# Altium project ZYNQ_IPMC.PrjPcb (part 1 of 2)
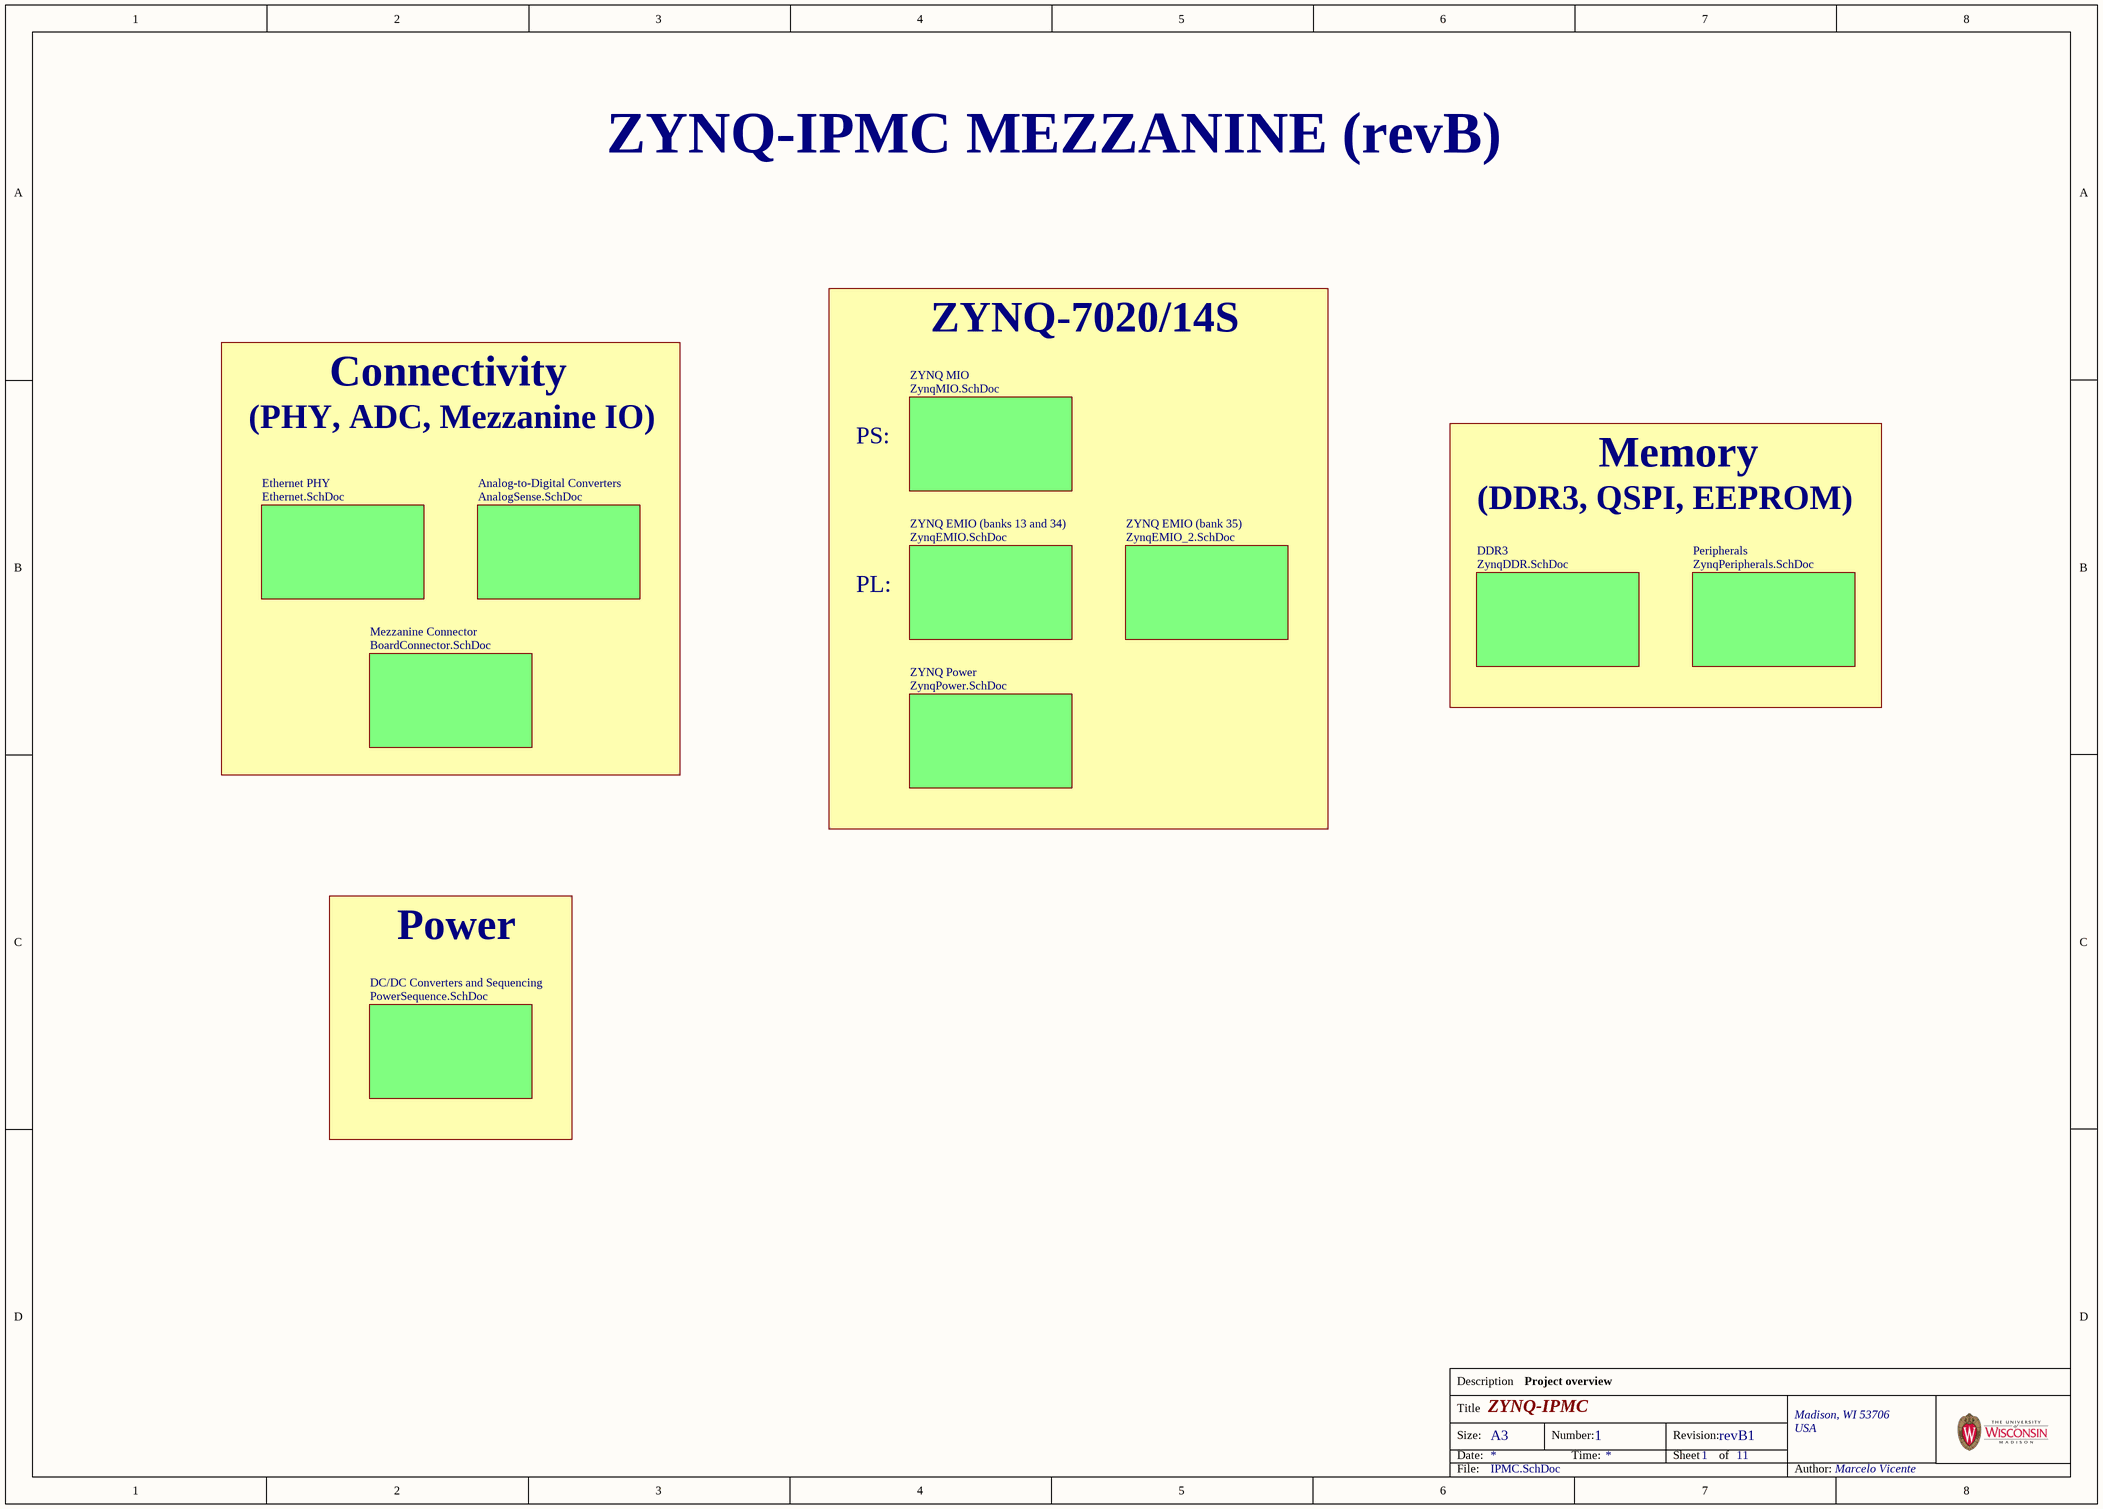
[diagram p0: IPMC.SchDoc]
Address1: Madison, WI 53706; Address2: USA; Author: Marcelo Vicente; Company: Univ. Wisconsin-Madison; Revision: revB1; Title: ZYNQ-IPMC
11 sheets, 308 parts. Net scope: global (net labels, ports and power ports of the same name join across sheets).
Board file: ZYNQ_IPMC.PcbDoc
Sheets:
  IPMC.SchDoc
    ZYNQ MIO = ZynqMIO.SchDoc
    ZYNQ EMIO (banks 13 and 34) = ZynqEMIO.SchDoc
    ZYNQ EMIO (bank 35) = ZynqEMIO_2.SchDoc
    ZYNQ Power = ZynqPower.SchDoc
    DDR3 = ZynqDDR.SchDoc
    Ethernet PHY = Ethernet.SchDoc
    Peripherals = ZynqPeripherals.SchDoc
    Analog-to-Digital Converters = AnalogSense.SchDoc
    DC/DC Converters and Sequencing = PowerSequence.SchDoc
    Mezzanine Connector = BoardConnector.SchDoc

## Sheet IPMC.SchDoc: ZYNQ-IPMC
size A3; Author: Marcelo Vicente; CompanyName: Univ. Wisconsin-Madison; Organization: Univ. Wisconsin-Madison; Address1: Madison, WI 53706; DocumentNumber: 1; Revision: revB1; SheetNumber: 1; SheetTotal: 11; ProjectName: ZYNQ-IPMC

### Sub-sheets
Analog-to-Digital Converters = AnalogSense.SchDoc: no entries
DC/DC Converters and Sequencing = PowerSequence.SchDoc: no entries
DDR3 = ZynqDDR.SchDoc: no entries
Ethernet PHY = Ethernet.SchDoc: no entries
Mezzanine Connector = BoardConnector.SchDoc: no entries
Peripherals = ZynqPeripherals.SchDoc: no entries
ZYNQ EMIO (bank 35) = ZynqEMIO_2.SchDoc: no entries
ZYNQ EMIO (banks 13 and 34) = ZynqEMIO.SchDoc: no entries
ZYNQ MIO = ZynqMIO.SchDoc: no entries
ZYNQ Power = ZynqPower.SchDoc: no entries

### Notes on the sheet
- ZYNQ-IPMC MEZZANINE (revB)
- ZYNQ-7020/14S
- (PHY, ADC, Mezzanine IO)
- Connectivity
- PS:
- (DDR3, QSPI, EEPROM)
- Memory
- PL:
- Power
- Project overview
- Description
- Title
- Size:
- Date:
- A3
- Number:
- Time:
- Revision:
- Sheet
- of
- File:
- Author:

## Sheet ZynqMIO.SchDoc: ZYNQ-IPMC
size A3; Author: Marcelo Vicente; CompanyName: Univ. Wisconsin-Madison; Organization: Univ. Wisconsin-Madison; Address1: Madison, WI 53706; DocumentNumber: 4; Revision: revB1; SheetNumber: 4; SheetTotal: 11; ProjectName: ZYNQ-IPMC
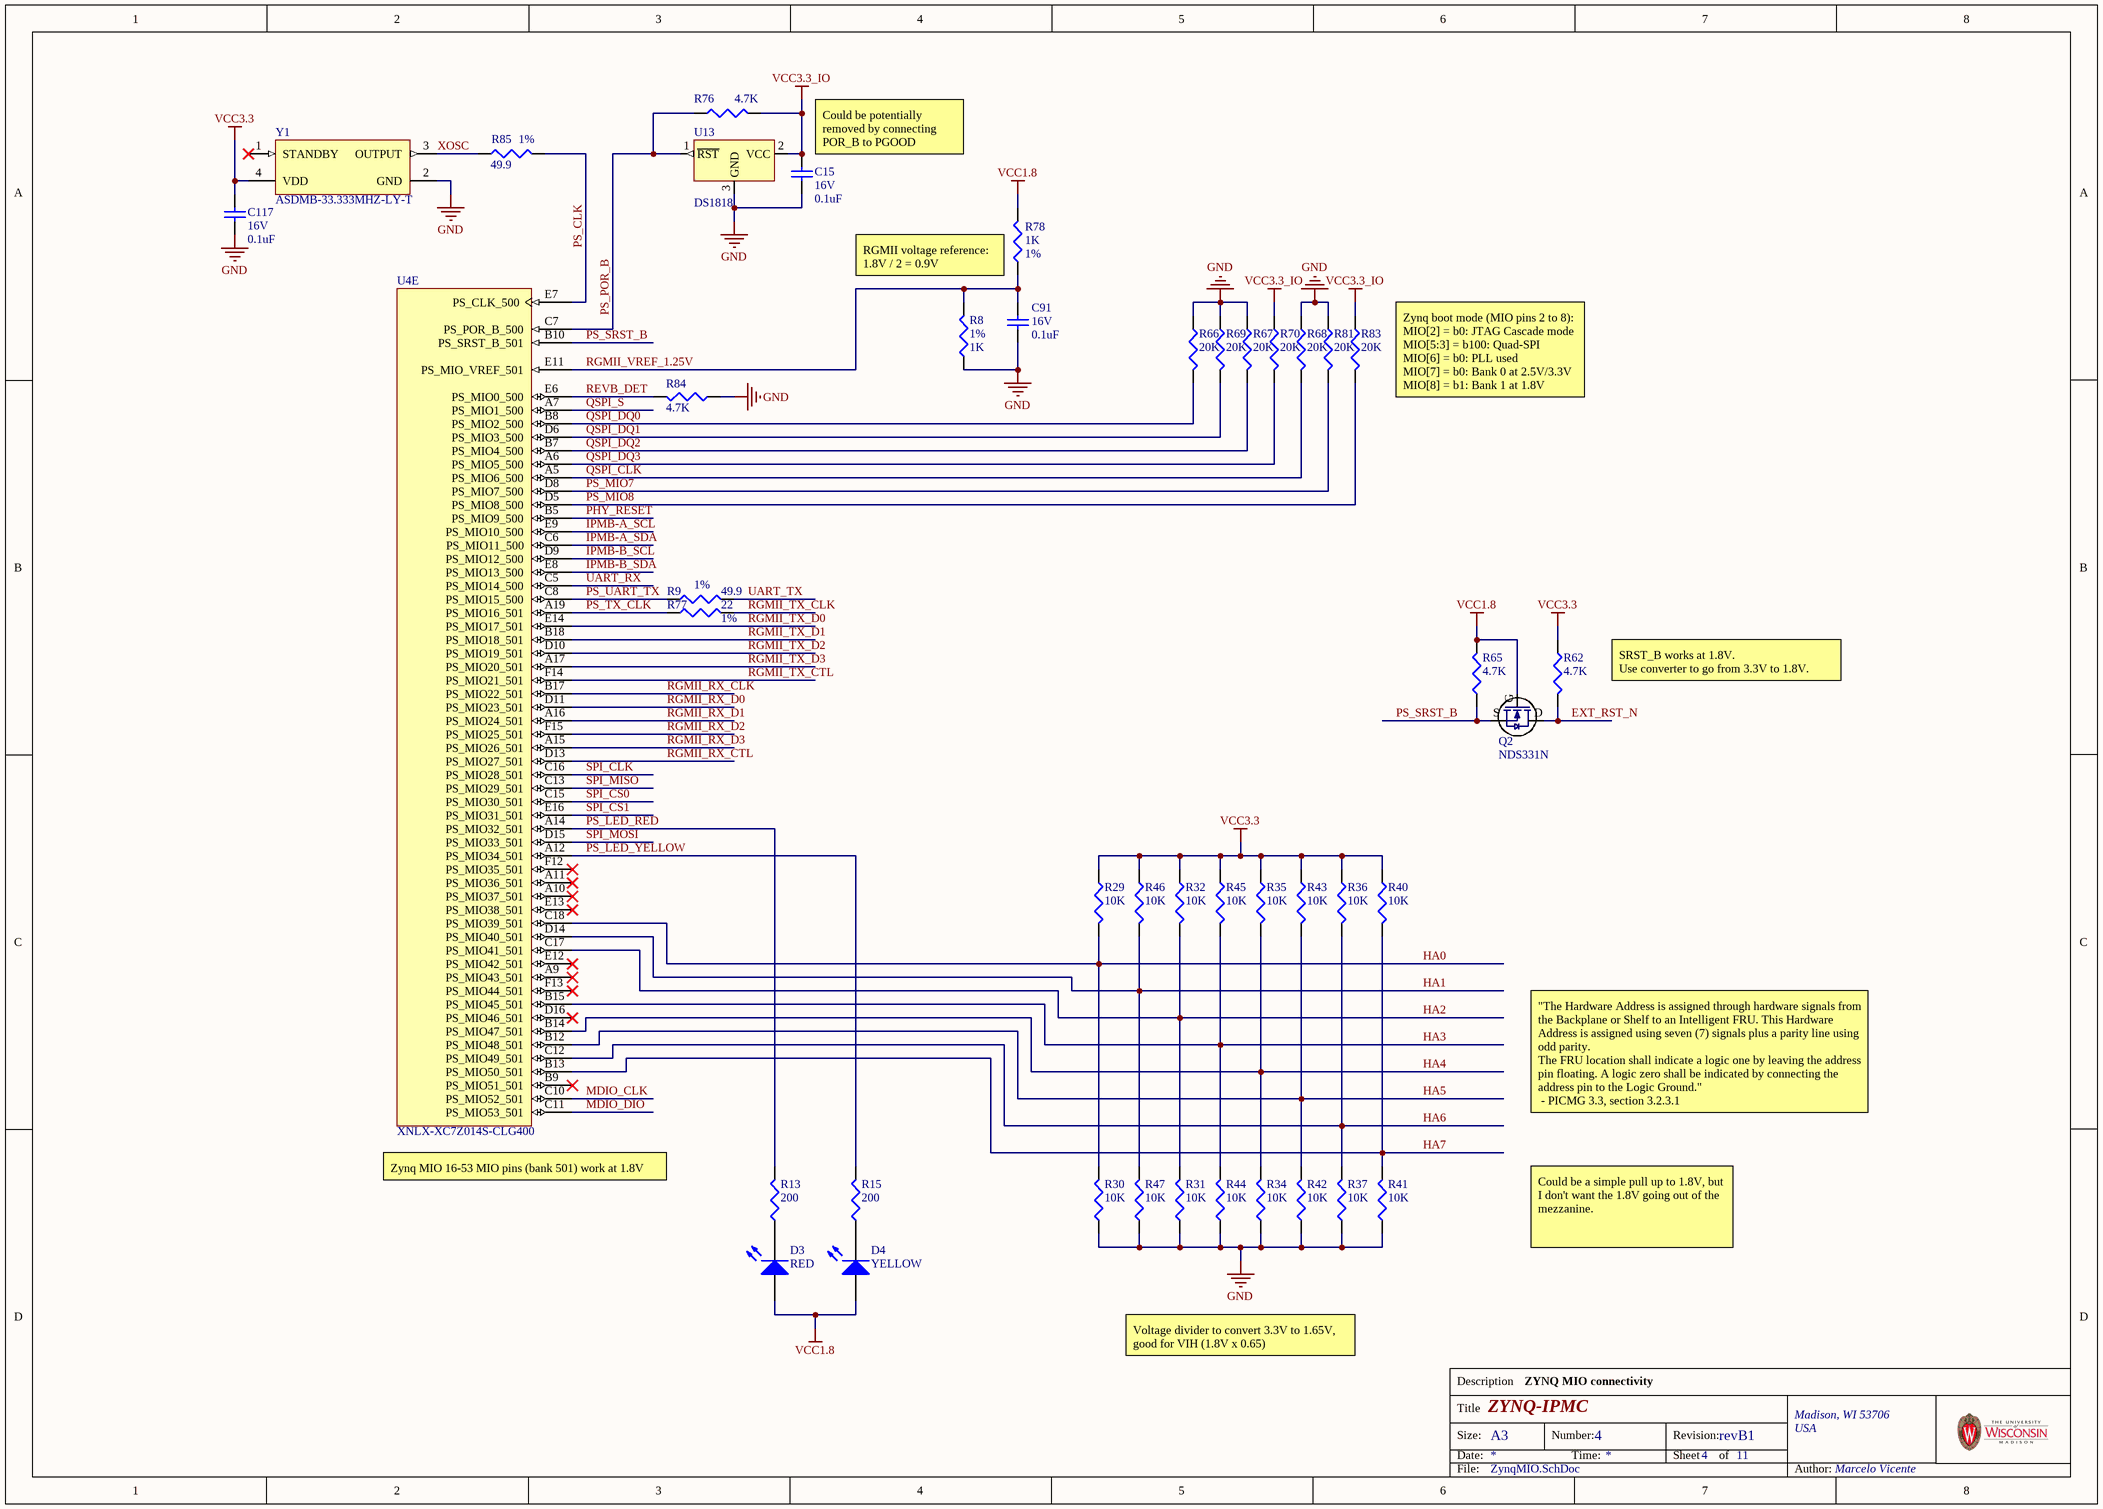
[diagram p1: ZynqMIO.SchDoc]

### Parts
C15  value 0.1uF  Rating: 16V  [C0402_IPC_H]  (hidden comment: ?)
C91  value 0.1uF  Rating: 16V  [C0402_IPC_H]  (hidden comment: ?)
C117  value 0.1uF  Rating: 16V  [C0402_IPC_H]  (hidden comment: ?)
D3  value RED  [LED0603_M]  (hidden comment: ?)
D4  value YELLOW  [LED0603_M]  (hidden comment: ?)
Q2  NDS331N  [SOT23-H]
R8  value 1K  Tolerance: 1%  [R0402_IPC_H]  (hidden comment: ?)
R9  value 49.9  Tolerance: 1%  [R0402_IPC_H]  (hidden comment: ?)
R13  value 200  [R0402_IPC_H]  (hidden comment: ?)
R15  value 200  [R0402_IPC_H]  (hidden comment: ?)
R29  value 10K  [R0201_IPC_H]  (hidden comment: ?)
R30  value 10K  [R0201_IPC_H]  (hidden comment: ?)
R31  value 10K  [R0201_IPC_H]  (hidden comment: ?)
R32  value 10K  [R0201_IPC_H]  (hidden comment: ?)
R34  value 10K  [R0201_IPC_H]  (hidden comment: ?)
R35  value 10K  [R0201_IPC_H]  (hidden comment: ?)
R36  value 10K  [R0201_IPC_H]  (hidden comment: ?)
R37  value 10K  [R0201_IPC_H]  (hidden comment: ?)
R40  value 10K  [R0201_IPC_H]  (hidden comment: ?)
R41  value 10K  [R0201_IPC_H]  (hidden comment: ?)
R42  value 10K  [R0201_IPC_H]  (hidden comment: ?)
R43  value 10K  [R0201_IPC_H]  (hidden comment: ?)
R44  value 10K  [R0201_IPC_H]  (hidden comment: ?)
R45  value 10K  [R0201_IPC_H]  (hidden comment: ?)
R46  value 10K  [R0201_IPC_H]  (hidden comment: ?)
R47  value 10K  [R0201_IPC_H]  (hidden comment: ?)
R62  value 4.7K  [R0402_IPC_H]  (hidden comment: ?)
R65  value 4.7K  [R0402_IPC_H]  (hidden comment: ?)
R66  value 20K  [R0402_IPC_H]  (hidden comment: ?)
R67  value 20K  [R0402_IPC_H]  (hidden comment: ?)
R68  value 20K  [R0402_IPC_H]  (hidden comment: ?)
R69  value 20K  [R0402_IPC_H]  (hidden comment: ?)
R70  value 20K  [R0402_IPC_H]  (hidden comment: ?)
R76  value 4.7K  [R0402_IPC_H]  (hidden comment: ?)
R77  value 22  Tolerance: 1%  [R0201_IPC_H]  (hidden comment: ?)
R78  value 1K  Tolerance: 1%  [R0402_IPC_H]  (hidden comment: ?)
R81  value 20K  [R0402_IPC_H]  (hidden comment: ?)
R83  value 20K  [R0402_IPC_H]  (hidden comment: ?)
R84  value 4.7K  [R0402_IPC_H]  (hidden comment: ?)
R85  value 49.9  Tolerance: 1%  [R0402_IPC_H]  (hidden comment: ?)
U4  XNLX-XC7Z014S-CLG400  [CLG400]  (part E of 9)
U13  DS1818  [SOT23-H]
Y1  ASDMB-33.333MHZ-LY-T  [ABRA-ASDMB-4_V]

### Nets
GND: C15.1 C91.1 C117.1 R8.2 R30.1 R31.1 R34.1 R37.1 R41.1 R42.1 R44.1 R47.1 R66.1 R67.1 R68.1 R69.1 R81.1 R84.1 U13.3(GND) Y1.2(GND)
VCC1.8: D3.1(A) D4.1(A) Q2.G R65.2 R78.1
VCC3.3: C117.2 R29.1 R32.1 R35.1 R36.1 R40.1 R43.1 R45.1 R46.1 R62.1 Y1.4(VDD)
VCC3.3_IO: C15.2 R70.1 R76.1 R83.1 U13.2(VCC)
~{QSPI_S}: U4.A7(PS_MIO1_500)
~{SPI_CS0}: U4.C15(PS_MIO30_501)
~{SPI_CS1}: U4.E16(PS_MIO31_501)
EXT_RST_N: Q2.D R62.2
HA0: R29.2 R30.2 U4.C18(PS_MIO39_501)
HA1: R46.2 R47.2 U4.D14(PS_MIO40_501)
HA2: R31.2 R32.2 U4.C17(PS_MIO41_501)
HA3: R44.2 R45.2 U4.B15(PS_MIO45_501)
HA4: R34.2 R35.2 U4.B14(PS_MIO47_501)
HA5: R42.2 R43.2 U4.B12(PS_MIO48_501)
HA6: R36.2 R37.2 U4.C12(PS_MIO49_501)
HA7: R40.2 R41.2 U4.B13(PS_MIO50_501)
IPMB-A_SCL: U4.E9(PS_MIO10_500)
IPMB-A_SDA: U4.C6(PS_MIO11_500)
IPMB-B_SCL: U4.D9(PS_MIO12_500)
IPMB-B_SDA: U4.E8(PS_MIO13_500)
MDIO_CLK: U4.C10(PS_MIO52_501)
MDIO_DIO: U4.C11(PS_MIO53_501)
PHY_RESET: U4.B5(PS_MIO9_500)
PS_CLK: R85.1 U4.E7(PS_CLK_500)
PS_LED_RED: R13.2 U4.A14(PS_MIO32_501)
PS_LED_YELLOW: R15.2 U4.A12(PS_MIO34_501)
PS_MIO7: R81.2 U4.D8(PS_MIO7_500)
PS_MIO8: R83.2 U4.D5(PS_MIO8_500)
PS_POR_B: R76.2 U4.C7(PS_POR_B_500) U13.1(~{RST})
PS_SRST_B: Q2.S R65.1 U4.B10(PS_SRST_B_501)
PS_TX_CLK: R77.1 U4.A19(PS_MIO16_501)
PS_UART_TX: R9.2 U4.C8(PS_MIO15_500)
QSPI_CLK: R68.2 U4.A5(PS_MIO6_500)
QSPI_DQ0: R66.2 U4.B8(PS_MIO2_500)
QSPI_DQ1: R69.2 U4.D6(PS_MIO3_500)
QSPI_DQ2: R67.2 U4.B7(PS_MIO4_500)
QSPI_DQ3: R70.2 U4.A6(PS_MIO5_500)
REVB_DET: R84.2 U4.E6(PS_MIO0_500)
RGMII_RX_CLK: U4.B17(PS_MIO22_501)
RGMII_RX_CTL: U4.D13(PS_MIO27_501)
RGMII_RX_D0: U4.D11(PS_MIO23_501)
RGMII_RX_D1: U4.A16(PS_MIO24_501)
RGMII_RX_D2: U4.F15(PS_MIO25_501)
RGMII_RX_D3: U4.A15(PS_MIO26_501)
RGMII_TX_CLK: R77.2
RGMII_TX_CTL: U4.F14(PS_MIO21_501)
RGMII_TX_D0: U4.E14(PS_MIO17_501)
RGMII_TX_D1: U4.B18(PS_MIO18_501)
RGMII_TX_D2: U4.D10(PS_MIO19_501)
RGMII_TX_D3: U4.A17(PS_MIO20_501)
RGMII_VREF_1.25V: C91.2 R8.1 R78.2 U4.E11(PS_MIO_VREF_501)
SPI_CLK: U4.C16(PS_MIO28_501)
SPI_MISO: U4.C13(PS_MIO29_501)
SPI_MOSI: U4.D15(PS_MIO33_501)
UART_RX: U4.C5(PS_MIO14_500)
UART_TX: R9.1
XOSC: R85.2 Y1.3(OUTPUT)
NetD3_2: D3.2(K) R13.1
NetD4_2: D4.2(K) R15.1

Not connected (* = marked no-connect by the designer): U4 A9(PS_MIO43_501)* A10(PS_MIO37_501)* A11(PS_MIO36_501)* B9(PS_MIO51_501)* D16(PS_MIO46_501)* E12(PS_MIO42_501)* E13(PS_MIO38_501)* F12(PS_MIO35_501)* F13(PS_MIO44_501)*; Y1 1(STANDBY)*

### Notes on the sheet
- (near C15) Could be potentially removed by connecting POR_B to PGOOD
- (near R78) RGMII voltage reference:
  1.8V / 2 = 0.9V
- (near R83) Zynq boot mode (MIO pins 2 to 8):
  MIO[2] = b0: JTAG Cascade mode
  MIO[5:3] = b100: Quad-SPI
  MIO[6] = b0: PLL used
  MIO[7] = b0: Bank 0 at 2.5V/3.3V
  MIO[8] = b1: Bank 1 at 1.8V
- SRST_B works at 1.8V.
  Use converter to go from 3.3V to 1.8V.
- "The Hardware Address is assigned through hardware signals from the Backplane or Shelf to an Intelligent FRU. This Hardware Address is assigned using seven (7) signals plus a parity line using odd parity.
  The FRU location shall indicate a logic one by leaving the address pin floating. A logic zero shall be indicated by connecting the address pin to the Logic Ground."
  - PICMG 3.3, section 3.2.3.1
- (near U4) Zynq MIO 16-53 MIO pins (bank 501) work at 1.8V
- Could be a simple pull up to 1.8V, but I don't want the 1.8V going out of the mezzanine.
- Voltage divider to convert 3.3V to 1.65V, good for VIH (1.8V x 0.65)
- ZYNQ MIO connectivity
- Description
- Title
- Size:
- Date:
- A3
- Number:
- Time:
- Revision:
- Sheet
- of
- File:
- Author:

### Library data of the parts
C15 C91 C117 = Cap: Capacitor; Manufacturer: Murata; Part: GRM155R71C104KA88D; INVKEY: CP0402-0.1UF-16V-10%; PackageDescription: Chip Capacitor
D3 = LED: Light Emitting Diode; Manufacturer: Lite-On; Part: LTST-C190KRKT; INVKEY: LED-RD-TOP-0603
D4 = LED: Light Emitting Diode; Manufacturer: Lite-On; Part: LTST-C190KSKT; INVKEY: LED-YLW-TOP-0603
Q2 = NDS331N: N-Channel   Logic Level Enhancement Mode Field Effect Transistor; pin to pad: D>3 G>1 S>2; Manufacturer: Fairchild; INVKEY: FET-NDS331N-SSOT23; Part: NDS331N
R8 R78 = Res: Resistor; Manufacturer: Panasonic-ECG; Part: ERJ-2RKF1001X; INVKEY: RS0402-1K-1/10W-1%; PackageDescription: Chip Resistor
R9 R85 = Res: Resistor; Manufacturer: Panasonic; Part: ERJ-2RKF49R9X; INVKEY: RS0402-49R9-1/10W-1%; PackageDescription: Chip Resistor
R13 R15 = Res: Resistor; Manufacturer: Panasonic-ECG; Part: ERJ-2RKF2000X; Tolerance: 1%; INVKEY: RS0402-200R-1/10W-1%; PackageDescription: Chip Resistor
R29-R32 R34-R37 R40-R47 = Res: Resistor; Manufacturer: Panasonic; Part: ERJ-1GNF1002C; Tolerance: 1%; INVKEY: RS0201-10K-1/20W-1%; PackageDescription: Chip Resistor
R62 R65 R76 R84 = Res: Resistor; Manufacturer: Panasonic; Part: ERJ-2RKF4701X; Tolerance: 1%; INVKEY: RS0402-4K7-1/10W-1%; PackageDescription: Chip Resistor
R66-R70 R81 R83 = Res: Resistor; Manufacturer: Panasonic-ECG; Part: ERJ-2RKF2002X; Tolerance: 1%; INVKEY: RS0402-20K-1/10W-1%; PackageDescription: Chip Resistor
R77 = Res: Resistor; Manufacturer: Panasonic; Part: ERJ-1GNF22R0C; INVKEY: RS0201-22R-1/20W-1%; PackageDescription: Chip Resistor
U4 = XNLX-XC7Z020-CLG400: Manufacturer: Xilinx; Part: XC7Z014S-1CLG400C; INVKEY: ?
U13 = DS1818: 3.3V EconoReset with Pushbutton; Manufacturer: Maxim; Part: DS1818R-10; INVKEY: IC-RST-1818R-10
Y1 = CMP-0728-00001-1: Plastic Package Clock Oscillator, 3.6864 MHz Frequency, 15 pF Output Load, 4-Pin 2.5 x 2 x 0.9 mm SMD, -40 to 85 degC, RoHS, Reel; PartNumber: ASDMB-3.6864MHZ-LC-T; Manufacturer: Abracon; Disable Stand-by Current: 15 uA Max.; Output Load: 15 pF; Startup Time: 1.5 ms Typ.; Overall Freq.Stability: +/- 50 ppm (STD); Supply Voltage: 1.8 to 3.3 V; Disable Time: 20 ns Typ.; INVKEY: CRY-ASDMB-33.333MHZ; ComponentLink1Description: Manufacturer URL; RoHS: TRUE; PackageVersion: Oct-13; PackageDescription: 4-Pin SMD, Body 2.5 x 2 mm, Height 0.9 mm; DatasheetVersion: Oct-13; ComponentLink3URL: http://www.abracon.com/Oscillators/ASDMB.pdf; ComponentLink2Description: Datasheet; Mounting Technology: Surface Mount; ComponentLink2URL: http://www.abracon.com/Oscillators/ASDMB.pdf; ComponentLink3Description: Package Specification; PackageReference: ASDMB-4; ComponentLink1URL: http://www.abracon.com/; Operating Temperature Range: -40 to 85 degC; Packing: Reel; Frequency: 33.333 MHz; Part: ASDMB-33.333MHZ-LY

## Sheet ZynqEMIO.SchDoc: ZYNQ-IPMC
size A3; Author: Marcelo Vicente; CompanyName: Univ. Wisconsin-Madison; Organization: Univ. Wisconsin-Madison; Address1: Madison, WI 53706; DocumentNumber: 5; Revision: revB1; SheetNumber: 5; SheetTotal: 11; ProjectName: ZYNQ-IPMC
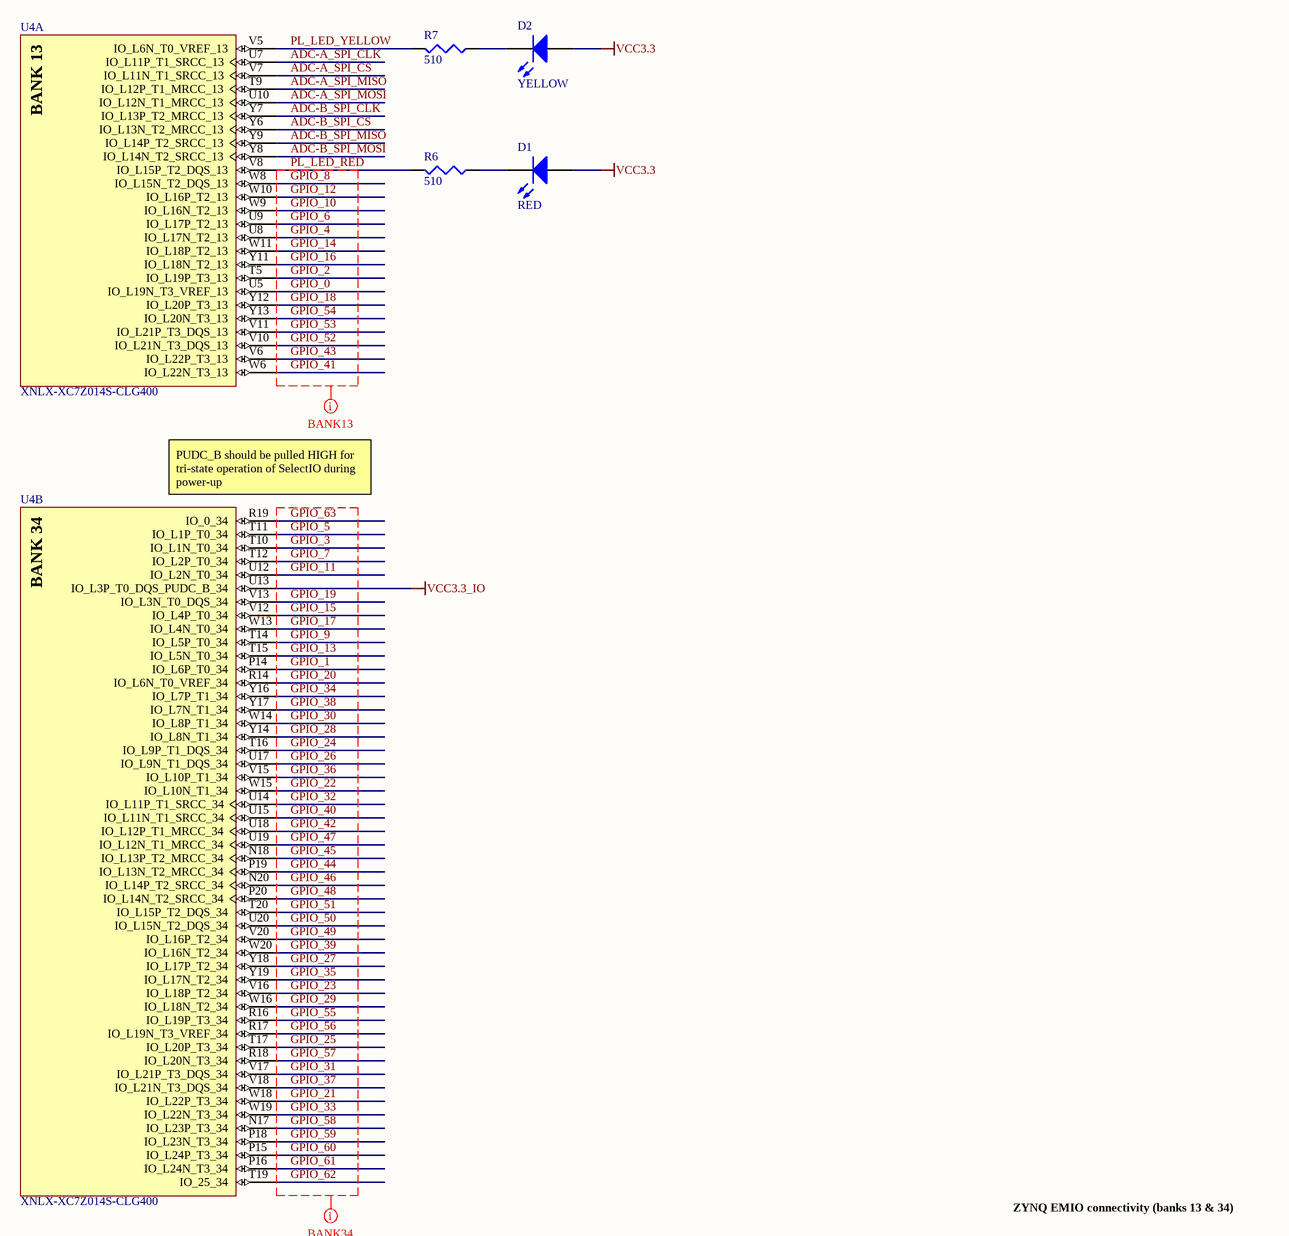
[diagram p2: ZynqEMIO.SchDoc]

### Parts
D1  value RED  [LED0603_M]  (hidden comment: ?)
D2  value YELLOW  [LED0603_M]  (hidden comment: ?)
R6  value 510  [R0402_IPC_H]  (hidden comment: ?)
R7  value 510  [R0402_IPC_H]  (hidden comment: ?)
U4  XNLX-XC7Z014S-CLG400  [CLG400]  (parts A,B of 9)

### Nets
VCC3.3: D1.1(A) D2.1(A)
VCC3.3_IO: U4.U13(IO_L3P_T0_DQS_PUDC_B_34)
~{ADC-A_SPI_CS}: U4.V7(IO_L11N_T1_SRCC_13)
~{ADC-B_SPI_CS}: U4.Y6(IO_L13N_T2_MRCC_13)
ADC-A_SPI_CLK: U4.U7(IO_L11P_T1_SRCC_13)
ADC-A_SPI_MISO: U4.T9(IO_L12P_T1_MRCC_13)
ADC-A_SPI_MOSI: U4.U10(IO_L12N_T1_MRCC_13)
ADC-B_SPI_CLK: U4.Y7(IO_L13P_T2_MRCC_13)
ADC-B_SPI_MISO: U4.Y9(IO_L14P_T2_SRCC_13)
ADC-B_SPI_MOSI: U4.Y8(IO_L14N_T2_SRCC_13)
GPIO_0: U4.U5(IO_L19N_T3_VREF_13)
GPIO_1: U4.P14(IO_L6P_T0_34)
GPIO_2: U4.T5(IO_L19P_T3_13)
GPIO_3: U4.T10(IO_L1N_T0_34)
GPIO_4: U4.U8(IO_L17N_T2_13)
GPIO_5: U4.T11(IO_L1P_T0_34)
GPIO_6: U4.U9(IO_L17P_T2_13)
GPIO_7: U4.T12(IO_L2P_T0_34)
GPIO_8: U4.W8(IO_L15N_T2_DQS_13)
GPIO_9: U4.T14(IO_L5P_T0_34)
GPIO_10: U4.W9(IO_L16N_T2_13)
GPIO_11: U4.U12(IO_L2N_T0_34)
GPIO_12: U4.W10(IO_L16P_T2_13)
GPIO_13: U4.T15(IO_L5N_T0_34)
GPIO_14: U4.W11(IO_L18P_T2_13)
GPIO_15: U4.V12(IO_L4P_T0_34)
GPIO_16: U4.Y11(IO_L18N_T2_13)
GPIO_17: U4.W13(IO_L4N_T0_34)
GPIO_18: U4.Y12(IO_L20P_T3_13)
GPIO_19: U4.V13(IO_L3N_T0_DQS_34)
GPIO_20: U4.R14(IO_L6N_T0_VREF_34)
GPIO_21: U4.W18(IO_L22P_T3_34)
GPIO_22: U4.W15(IO_L10N_T1_34)
GPIO_23: U4.V16(IO_L18P_T2_34)
GPIO_24: U4.T16(IO_L9P_T1_DQS_34)
GPIO_25: U4.T17(IO_L20P_T3_34)
GPIO_26: U4.U17(IO_L9N_T1_DQS_34)
GPIO_27: U4.Y18(IO_L17P_T2_34)
GPIO_28: U4.Y14(IO_L8N_T1_34)
GPIO_29: U4.W16(IO_L18N_T2_34)
GPIO_30: U4.W14(IO_L8P_T1_34)
GPIO_31: U4.V17(IO_L21P_T3_DQS_34)
GPIO_32: U4.U14(IO_L11P_T1_SRCC_34)
GPIO_33: U4.W19(IO_L22N_T3_34)
GPIO_34: U4.Y16(IO_L7P_T1_34)
GPIO_35: U4.Y19(IO_L17N_T2_34)
GPIO_36: U4.V15(IO_L10P_T1_34)
GPIO_37: U4.V18(IO_L21N_T3_DQS_34)
GPIO_38: U4.Y17(IO_L7N_T1_34)
GPIO_39: U4.W20(IO_L16N_T2_34)
GPIO_40: U4.U15(IO_L11N_T1_SRCC_34)
GPIO_41: U4.W6(IO_L22N_T3_13)
GPIO_42: U4.U18(IO_L12P_T1_MRCC_34)
GPIO_43: U4.V6(IO_L22P_T3_13)
GPIO_44: U4.P19(IO_L13N_T2_MRCC_34)
GPIO_45: U4.N18(IO_L13P_T2_MRCC_34)
GPIO_46: U4.N20(IO_L14P_T2_SRCC_34)
GPIO_47: U4.U19(IO_L12N_T1_MRCC_34)
GPIO_48: U4.P20(IO_L14N_T2_SRCC_34)
GPIO_49: U4.V20(IO_L16P_T2_34)
GPIO_50: U4.U20(IO_L15N_T2_DQS_34)
GPIO_51: U4.T20(IO_L15P_T2_DQS_34)
GPIO_52: U4.V10(IO_L21N_T3_DQS_13)
GPIO_53: U4.V11(IO_L21P_T3_DQS_13)
GPIO_54: U4.Y13(IO_L20N_T3_13)
GPIO_55: U4.R16(IO_L19P_T3_34)
GPIO_56: U4.R17(IO_L19N_T3_VREF_34)
GPIO_57: U4.R18(IO_L20N_T3_34)
GPIO_58: U4.N17(IO_L23P_T3_34)
GPIO_59: U4.P18(IO_L23N_T3_34)
GPIO_60: U4.P15(IO_L24P_T3_34)
GPIO_61: U4.P16(IO_L24N_T3_34)
GPIO_62: U4.T19(IO_25_34)
GPIO_63: U4.R19(IO_0_34)
PL_LED_RED: R6.2 U4.V8(IO_L15P_T2_DQS_13)
PL_LED_YELLOW: R7.2 U4.V5(IO_L6N_T0_VREF_13)
NetD1_2: D1.2(K) R6.1
NetD2_2: D2.2(K) R7.1

### Layout directives
net class BANK13: GPIO_0, GPIO_2, GPIO_4, GPIO_6, GPIO_8, GPIO_10, GPIO_12, GPIO_14, GPIO_16, GPIO_18, GPIO_41, GPIO_43, GPIO_52, GPIO_53, GPIO_54, PL_LED_RED
net class BANK34: GPIO_1, GPIO_3, GPIO_5, GPIO_7, GPIO_9, GPIO_11, GPIO_13, GPIO_15, GPIO_17, GPIO_19, GPIO_20, GPIO_21, GPIO_22, GPIO_23, GPIO_24, GPIO_25, GPIO_26, GPIO_27, GPIO_28, GPIO_29, GPIO_30, GPIO_31, GPIO_32, GPIO_33, GPIO_34, GPIO_35, GPIO_36, GPIO_37, GPIO_38, GPIO_39, GPIO_40, GPIO_42, GPIO_44, GPIO_45, GPIO_46, GPIO_47, GPIO_48, GPIO_49, GPIO_50, GPIO_51, GPIO_55, GPIO_56, GPIO_57, GPIO_58, GPIO_59, GPIO_60, GPIO_61, GPIO_62, GPIO_63

### Notes on the sheet
- (near U4) PUDC_B should be pulled HIGH for tri-state operation of SelectIO during power-up
- ZYNQ EMIO connectivity (banks 13 & 34)
- Description
- Title
- Size:
- Date:
- A3
- Number:
- Time:
- Revision:
- Sheet
- of
- File:
- Author:
- (in symbol XNLX-XC7Z020-CLG400, part A) BANK 13
- (in symbol XNLX-XC7Z020-CLG400, part B) BANK 34

### Library data of the parts
D1 = LED: as D3 on sheet ZynqMIO
D2 = LED: as D4 on sheet ZynqMIO
R6 R7 = Res: Resistor; Manufacturer: Panasonic-ECG; Part: ERJ-2RKF5100X; Tolerance: 1%; INVKEY: RS0402-510R-1/10W-1%; PackageDescription: Chip Resistor
U4 = XNLX-XC7Z020-CLG400: as U4 on sheet ZynqMIO; INVKEY: ?

## Sheet ZynqEMIO_2.SchDoc: ZYNQ-IPMC
size A3; Author: Marcelo Vicente; CompanyName: Univ. Wisconsin-Madison; Organization: Univ. Wisconsin-Madison; Address1: Madison, WI 53706; DocumentNumber: 6; Revision: revB1; SheetNumber: 6; SheetTotal: 11; ProjectName: ZYNQ-IPMC
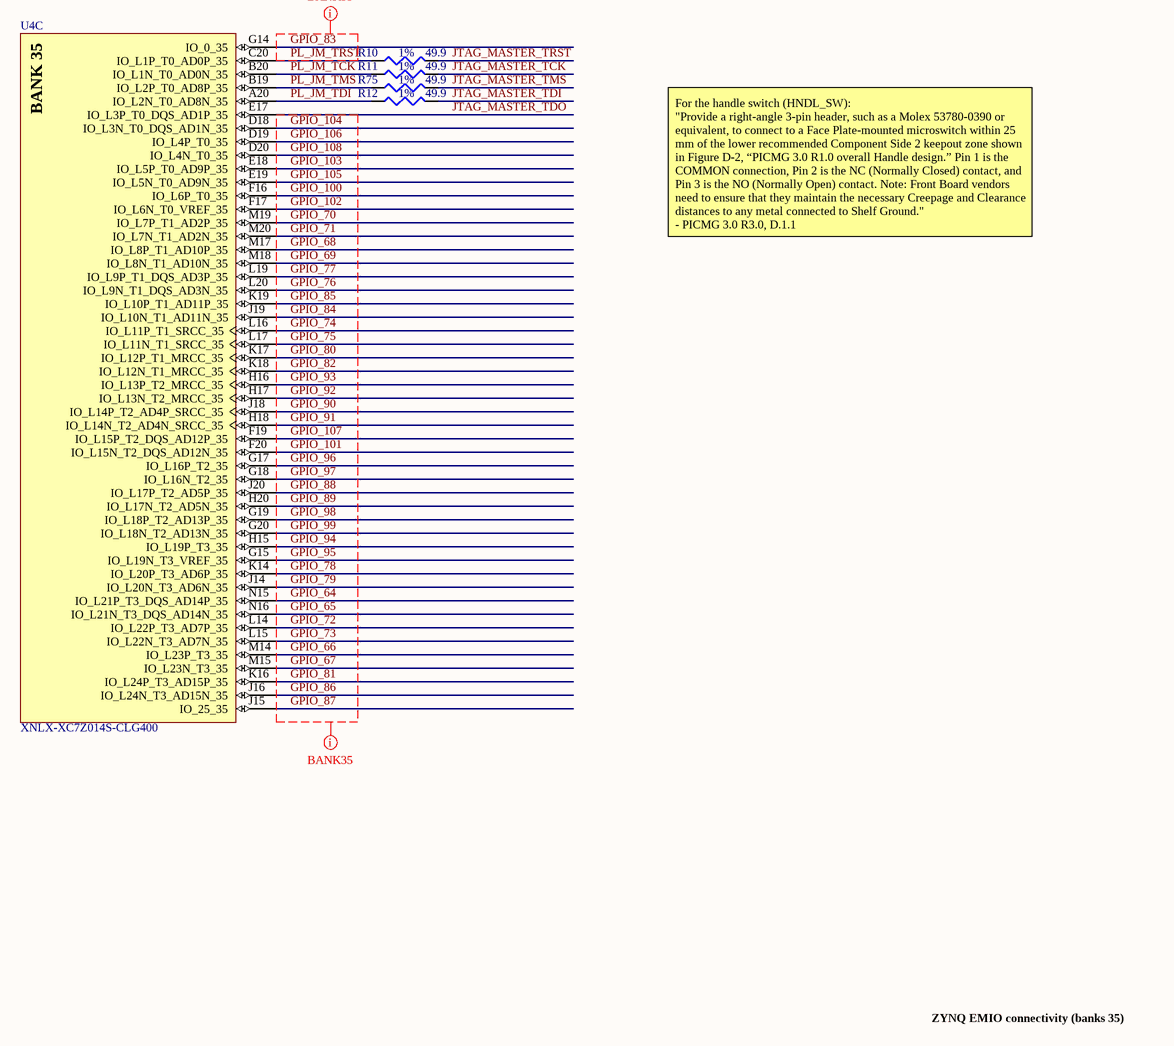
[diagram p3: ZynqEMIO_2.SchDoc]

### Parts
R10  value 49.9  Tolerance: 1%  [R0402_IPC_H]  (hidden comment: ?)
R11  value 49.9  Tolerance: 1%  [R0402_IPC_H]  (hidden comment: ?)
R12  value 49.9  Tolerance: 1%  [R0402_IPC_H]  (hidden comment: ?)
R75  value 49.9  Tolerance: 1%  [R0402_IPC_H]  (hidden comment: ?)
U4  XNLX-XC7Z014S-CLG400  [CLG400]  (part C of 9)

### Nets
GPIO_64: U4.N15(IO_L21P_T3_DQS_AD14P_35)
GPIO_65: U4.N16(IO_L21N_T3_DQS_AD14N_35)
GPIO_66: U4.M14(IO_L23P_T3_35)
GPIO_67: U4.M15(IO_L23N_T3_35)
GPIO_68: U4.M17(IO_L8P_T1_AD10P_35)
GPIO_69: U4.M18(IO_L8N_T1_AD10N_35)
GPIO_70: U4.M19(IO_L7P_T1_AD2P_35)
GPIO_71: U4.M20(IO_L7N_T1_AD2N_35)
GPIO_72: U4.L14(IO_L22P_T3_AD7P_35)
GPIO_73: U4.L15(IO_L22N_T3_AD7N_35)
GPIO_74: U4.L16(IO_L11P_T1_SRCC_35)
GPIO_75: U4.L17(IO_L11N_T1_SRCC_35)
GPIO_76: U4.L20(IO_L9N_T1_DQS_AD3N_35)
GPIO_77: U4.L19(IO_L9P_T1_DQS_AD3P_35)
GPIO_78: U4.K14(IO_L20P_T3_AD6P_35)
GPIO_79: U4.J14(IO_L20N_T3_AD6N_35)
GPIO_80: U4.K17(IO_L12P_T1_MRCC_35)
GPIO_81: U4.K16(IO_L24P_T3_AD15P_35)
GPIO_82: U4.K18(IO_L12N_T1_MRCC_35)
GPIO_83: U4.G14(IO_0_35)
GPIO_84: U4.J19(IO_L10N_T1_AD11N_35)
GPIO_85: U4.K19(IO_L10P_T1_AD11P_35)
GPIO_86: U4.J16(IO_L24N_T3_AD15N_35)
GPIO_87: U4.J15(IO_25_35)
GPIO_88: U4.J20(IO_L17P_T2_AD5P_35)
GPIO_89: U4.H20(IO_L17N_T2_AD5N_35)
GPIO_90: U4.J18(IO_L14P_T2_AD4P_SRCC_35)
GPIO_91: U4.H18(IO_L14N_T2_AD4N_SRCC_35)
GPIO_92: U4.H17(IO_L13N_T2_MRCC_35)
GPIO_93: U4.H16(IO_L13P_T2_MRCC_35)
GPIO_94: U4.H15(IO_L19P_T3_35)
GPIO_95: U4.G15(IO_L19N_T3_VREF_35)
GPIO_96: U4.G17(IO_L16P_T2_35)
GPIO_97: U4.G18(IO_L16N_T2_35)
GPIO_98: U4.G19(IO_L18P_T2_AD13P_35)
GPIO_99: U4.G20(IO_L18N_T2_AD13N_35)
GPIO_100: U4.F16(IO_L6P_T0_35)
GPIO_101: U4.F20(IO_L15N_T2_DQS_AD12N_35)
GPIO_102: U4.F17(IO_L6N_T0_VREF_35)
GPIO_103: U4.E18(IO_L5P_T0_AD9P_35)
GPIO_104: U4.D18(IO_L3N_T0_DQS_AD1N_35)
GPIO_105: U4.E19(IO_L5N_T0_AD9N_35)
GPIO_106: U4.D19(IO_L4P_T0_35)
GPIO_107: U4.F19(IO_L15P_T2_DQS_AD12P_35)
GPIO_108: U4.D20(IO_L4N_T0_35)
JTAG_MASTER_TCK: R11.1
JTAG_MASTER_TDI: R12.1
JTAG_MASTER_TDO: U4.E17(IO_L3P_T0_DQS_AD1P_35)
JTAG_MASTER_TMS: R75.1
JTAG_MASTER_TRST: R10.1
PL_JM_TCK: R11.2 U4.B20(IO_L1N_T0_AD0N_35)
PL_JM_TDI: R12.2 U4.A20(IO_L2N_T0_AD8N_35)
PL_JM_TMS: R75.2 U4.B19(IO_L2P_T0_AD8P_35)
PL_JM_TRST: R10.2 U4.C20(IO_L1P_T0_AD0P_35)

### Layout directives
net class BANK35: GPIO_64, GPIO_65, GPIO_66, GPIO_67, GPIO_68, GPIO_69, GPIO_70, GPIO_71, GPIO_72, GPIO_73, GPIO_74, GPIO_75, GPIO_76, GPIO_77, GPIO_78, GPIO_79, GPIO_80, GPIO_81, GPIO_82, GPIO_83, GPIO_84, GPIO_85, GPIO_86, GPIO_87, GPIO_88, GPIO_89, GPIO_90, GPIO_91, GPIO_92, GPIO_93, GPIO_94, GPIO_95, GPIO_96, GPIO_97, GPIO_98, GPIO_99, GPIO_100, GPIO_101, GPIO_102, GPIO_103, GPIO_104, GPIO_105, GPIO_106, GPIO_107, GPIO_108, PL_JM_TRST

### Notes on the sheet
- For the handle switch (HNDL_SW):
  "Provide a right-angle 3-pin header, such as a Molex 53780-0390 or equivalent, to connect to a Face Plate-mounted microswitch within 25 mm of the lower recommended Component Side 2 keepout zone shown in Figure D-2, “PICMG 3.0 R1.0 overall Handle design.” Pin 1 is the COMMON connection, Pin 2 is the NC (Normally Closed) contact, and Pin 3 is the NO (Normally Open) contact. Note: Front Board vendors need to ensure that they maintain the necessary Creepage and Clearance distances to any metal connected to Shelf Ground."
  - PICMG 3.0 R3.0, D.1.1
- ZYNQ EMIO connectivity (banks 35)
- Description
- Title
- Size:
- Date:
- A3
- Number:
- Time:
- Revision:
- Sheet
- of
- File:
- Author:
- (in symbol XNLX-XC7Z020-CLG400, part C) BANK 35

### Library data of the parts
R10-R12 R75 = Res: as R9 on sheet ZynqMIO; PackageDescription: Chip Resistor
U4 = XNLX-XC7Z020-CLG400: as U4 on sheet ZynqMIO; INVKEY: ?

## Sheet ZynqPower.SchDoc: ZYNQ-IPMC
size A3; Author: Marcelo Vicente; CompanyName: Univ. Wisconsin-Madison; Organization: Univ. Wisconsin-Madison; Address1: Madison, WI 53706; DocumentNumber: 3; Revision: revB1; SheetNumber: 3; SheetTotal: 11; ProjectName: ZYNQ-IPMC
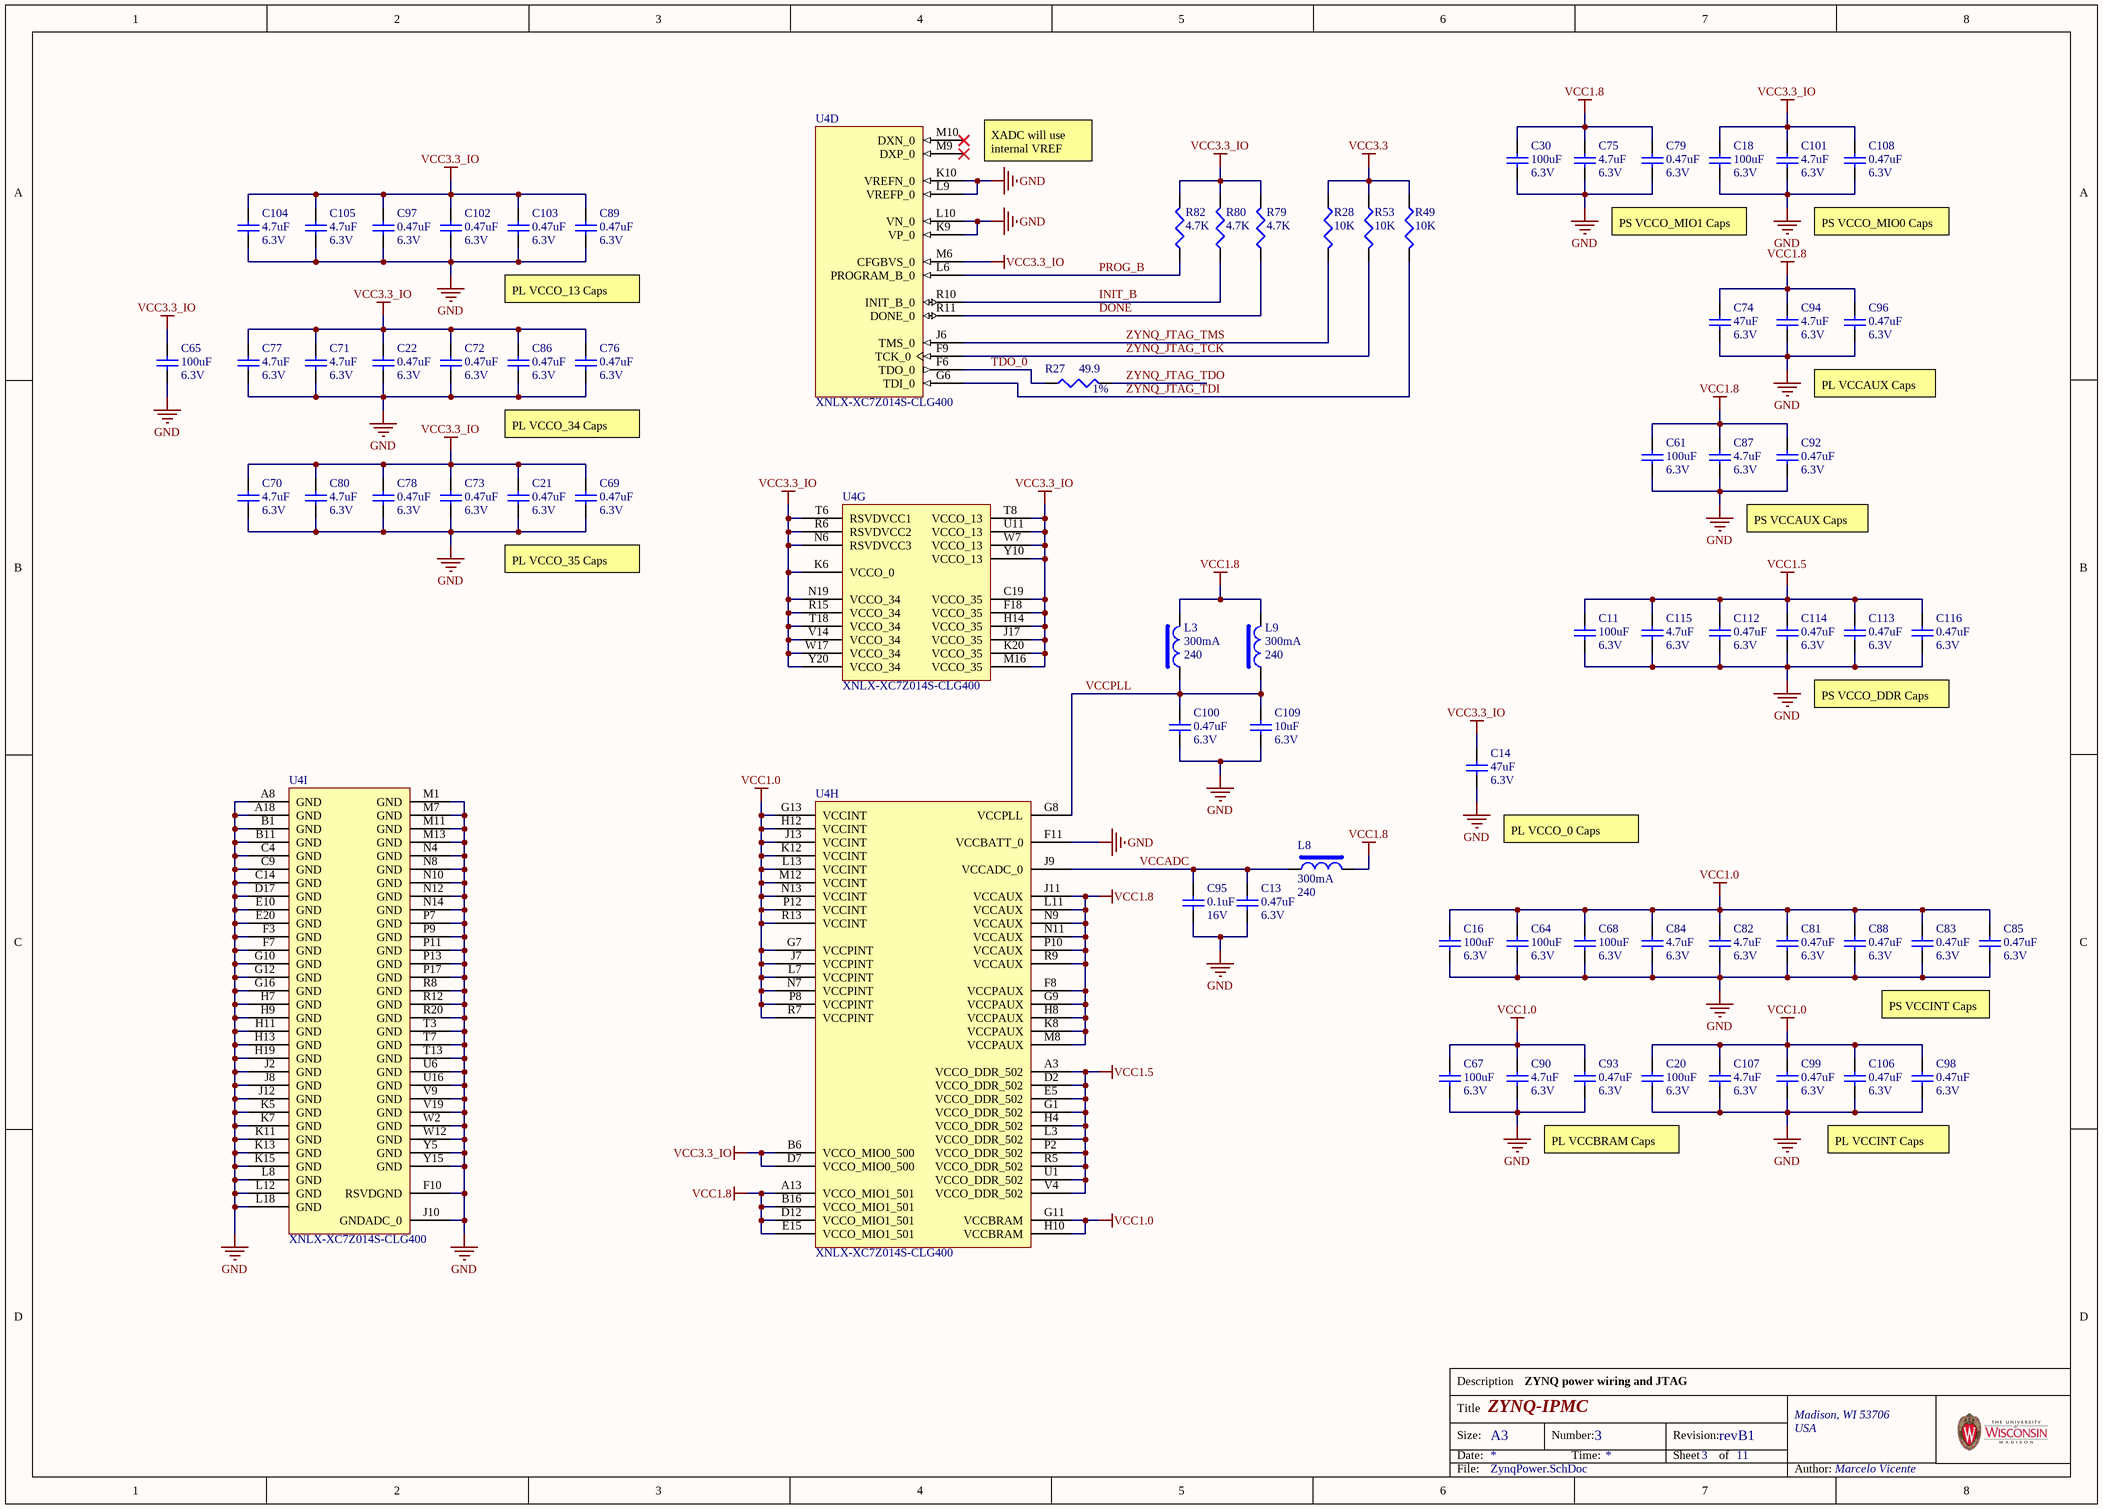
[diagram p4: ZynqPower.SchDoc]

### Parts
C11  value 100uF  Rating: 6.3V  [C1210_IPC_H]  (hidden comment: ?)
C13  value 0.47uF  Rating: 6.3V  [C0402_IPC_H]  (hidden comment: ?)
C14  value 47uF  Rating: 6.3V  [C0805_M]  (hidden comment: ?)
C16  value 100uF  Rating: 6.3V  [C1210_IPC_H]  (hidden comment: ?)
C18  value 100uF  Rating: 6.3V  [C1210_IPC_H]  (hidden comment: ?)
C20  value 100uF  Rating: 6.3V  [C1210_IPC_H]  (hidden comment: ?)
C21  value 0.47uF  Rating: 6.3V  [C0402_IPC_H]  (hidden comment: ?)
C22  value 0.47uF  Rating: 6.3V  [C0402_IPC_H]  (hidden comment: ?)
C30  value 100uF  Rating: 6.3V  [C1210_IPC_H]  (hidden comment: ?)
C61  value 100uF  Rating: 6.3V  [C1210_IPC_H]  (hidden comment: ?)
C64  value 100uF  Rating: 6.3V  [C1210_IPC_H]  (hidden comment: ?)
C65  value 100uF  Rating: 6.3V  [C1210_IPC_H]  (hidden comment: ?)
C67  value 100uF  Rating: 6.3V  [C1210_IPC_H]  (hidden comment: ?)
C68  value 100uF  Rating: 6.3V  [C1210_IPC_H]  (hidden comment: ?)
C69  value 0.47uF  Rating: 6.3V  [C0402_IPC_H]  (hidden comment: ?)
C70  value 4.7uF  Rating: 6.3V  [C0402_IPC_H]  (hidden comment: ?)
C71  value 4.7uF  Rating: 6.3V  [C0402_IPC_H]  (hidden comment: ?)
C72  value 0.47uF  Rating: 6.3V  [C0402_IPC_H]  (hidden comment: ?)
C73  value 0.47uF  Rating: 6.3V  [C0402_IPC_H]  (hidden comment: ?)
C74  value 47uF  Rating: 6.3V  [C0805_M]  (hidden comment: ?)
C75  value 4.7uF  Rating: 6.3V  [C0402_IPC_H]  (hidden comment: ?)
C76  value 0.47uF  Rating: 6.3V  [C0402_IPC_H]  (hidden comment: ?)
C77  value 4.7uF  Rating: 6.3V  [C0402_IPC_H]  (hidden comment: ?)
C78  value 0.47uF  Rating: 6.3V  [C0402_IPC_H]  (hidden comment: ?)
C79  value 0.47uF  Rating: 6.3V  [C0402_IPC_H]  (hidden comment: ?)
C80  value 4.7uF  Rating: 6.3V  [C0402_IPC_H]  (hidden comment: ?)
C81  value 0.47uF  Rating: 6.3V  [C0402_IPC_H]  (hidden comment: ?)
C82  value 4.7uF  Rating: 6.3V  [C0402_IPC_H]  (hidden comment: ?)
C83  value 0.47uF  Rating: 6.3V  [C0402_IPC_H]  (hidden comment: ?)
C84  value 4.7uF  Rating: 6.3V  [C0402_IPC_H]  (hidden comment: ?)
C85  value 0.47uF  Rating: 6.3V  [C0402_IPC_H]  (hidden comment: ?)
C86  value 0.47uF  Rating: 6.3V  [C0402_IPC_H]  (hidden comment: ?)
C87  value 4.7uF  Rating: 6.3V  [C0402_IPC_H]  (hidden comment: ?)
C88  value 0.47uF  Rating: 6.3V  [C0402_IPC_H]  (hidden comment: ?)
C89  value 0.47uF  Rating: 6.3V  [C0402_IPC_H]  (hidden comment: ?)
C90  value 4.7uF  Rating: 6.3V  [C0402_IPC_H]  (hidden comment: ?)
C92  value 0.47uF  Rating: 6.3V  [C0402_IPC_H]  (hidden comment: ?)
C93  value 0.47uF  Rating: 6.3V  [C0402_IPC_H]  (hidden comment: ?)
C94  value 4.7uF  Rating: 6.3V  [C0402_IPC_H]  (hidden comment: ?)
C95  value 0.1uF  Rating: 16V  [C0402_IPC_H]  (hidden comment: ?)
C96  value 0.47uF  Rating: 6.3V  [C0402_IPC_H]  (hidden comment: ?)
C97  value 0.47uF  Rating: 6.3V  [C0402_IPC_H]  (hidden comment: ?)
C98  value 0.47uF  Rating: 6.3V  [C0402_IPC_H]  (hidden comment: ?)
C99  value 0.47uF  Rating: 6.3V  [C0402_IPC_H]  (hidden comment: ?)
C100  value 0.47uF  Rating: 6.3V  [C0402_IPC_H]  (hidden comment: ?)
C101  value 4.7uF  Rating: 6.3V  [C0402_IPC_H]  (hidden comment: ?)
C102  value 0.47uF  Rating: 6.3V  [C0402_IPC_H]  (hidden comment: ?)
C103  value 0.47uF  Rating: 6.3V  [C0402_IPC_H]  (hidden comment: ?)
C104  value 4.7uF  Rating: 6.3V  [C0402_IPC_H]  (hidden comment: ?)
C105  value 4.7uF  Rating: 6.3V  [C0402_IPC_H]  (hidden comment: ?)
C106  value 0.47uF  Rating: 6.3V  [C0402_IPC_H]  (hidden comment: ?)
C107  value 4.7uF  Rating: 6.3V  [C0402_IPC_H]  (hidden comment: ?)
C108  value 0.47uF  Rating: 6.3V  [C0402_IPC_H]  (hidden comment: ?)
C109  value 10uF  Rating: 6.3V  [C0402_IPC_H]  (hidden comment: ?)
C112  value 0.47uF  Rating: 6.3V  [C0402_IPC_H]  (hidden comment: ?)
C113  value 0.47uF  Rating: 6.3V  [C0402_IPC_H]  (hidden comment: ?)
C114  value 0.47uF  Rating: 6.3V  [C0402_IPC_H]  (hidden comment: ?)
C115  value 4.7uF  Rating: 6.3V  [C0402_IPC_H]  (hidden comment: ?)
C116  value 0.47uF  Rating: 6.3V  [C0402_IPC_H]  (hidden comment: ?)
L3  value 240  Rated Current: 300mA  [L0402_H]  (hidden comment: BK1005HM241-T)
L8  value 240  Rated Current: 300mA  [L0402_H]  (hidden comment: BK1005HM241-T)
L9  value 240  Rated Current: 300mA  [L0402_H]  (hidden comment: BK1005HM241-T)
R27  value 49.9  Tolerance: 1%  [R0402_IPC_H]  (hidden comment: ?)
R28  value 10K  [R0402_IPC_H]  (hidden comment: ?)
R49  value 10K  [R0402_IPC_H]  (hidden comment: ?)
R53  value 10K  [R0402_IPC_H]  (hidden comment: ?)
R79  value 4.7K  [R0402_IPC_H]  (hidden comment: ?)
R80  value 4.7K  [R0402_IPC_H]  (hidden comment: ?)
R82  value 4.7K  [R0402_IPC_H]  (hidden comment: ?)
U4  XNLX-XC7Z014S-CLG400  [CLG400]  (parts D,G,H,I of 9)

### Nets
GND: C11.2 C13.2 C14.2 C16.2 C18.2 C20.2 C21.2 C22.2 C30.2 C61.2 C64.2 C65.2 C67.2 C68.2 C69.2 C70.2 C71.2 C72.2 C73.2 C74.2 C75.2 C76.2 C77.2 C78.2 C79.2 C80.2 C81.2 C82.2 C83.2 C84.2 C85.2 C86.2 C87.2 C88.2 C89.2 C90.2 C92.2 C93.2 C94.2 C95.2 C96.2 C97.2 C98.2 C99.2 C100.2 C101.2 C102.2 C103.2 C104.2 C105.2 C106.2 C107.2 C108.2 C109.2 C112.2 C113.2 C114.2 C115.2 C116.2 U4.A8(GND) U4.A18(GND) U4.B1(GND) U4.B11(GND) U4.C4(GND) U4.C9(GND) U4.C14(GND) U4.D17(GND) U4.E10(GND) U4.E20(GND) U4.F3(GND) U4.F7(GND) U4.F10(RSVDGND) U4.F11(VCCBATT_0) U4.G10(GND) U4.G12(GND) U4.G16(GND) U4.H7(GND) U4.H9(GND) U4.H11(GND) U4.H13(GND) U4.H19(GND) U4.J2(GND) U4.J8(GND) U4.J10(GNDADC_0) U4.J12(GND) U4.K5(GND) U4.K7(GND) U4.K9(VP_0) U4.K10(VREFN_0) U4.K11(GND) U4.K13(GND) U4.K15(GND) U4.L8(GND) U4.L9(VREFP_0) U4.L10(VN_0) U4.L12(GND) U4.L18(GND) U4.M1(GND) U4.M7(GND) U4.M11(GND) U4.M13(GND) U4.N4(GND) U4.N8(GND) U4.N10(GND) U4.N12(GND) U4.N14(GND) U4.P7(GND) U4.P9(GND) U4.P11(GND) U4.P13(GND) U4.P17(GND) U4.R8(GND) U4.R12(GND) U4.R20(GND) U4.T3(GND) U4.T7(GND) U4.T13(GND) U4.U6(GND) U4.U16(GND) U4.V9(GND) U4.V19(GND) U4.W2(GND) U4.W12(GND) U4.Y5(GND) U4.Y15(GND)
VCC1.0: C16.1 C20.1 C64.1 C67.1 C68.1 C81.1 C82.1 C83.1 C84.1 C85.1 C88.1 C90.1 C93.1 C98.1 C99.1 C106.1 C107.1 U4.G7(VCCPINT) U4.G11(VCCBRAM) U4.G13(VCCINT) U4.H10(VCCBRAM) U4.H12(VCCINT) U4.J7(VCCPINT) U4.J13(VCCINT) U4.K12(VCCINT) U4.L7(VCCPINT) U4.L13(VCCINT) U4.M12(VCCINT) U4.N7(VCCPINT) U4.N13(VCCINT) U4.P8(VCCPINT) U4.P12(VCCINT) U4.R7(VCCPINT) U4.R13(VCCINT)
VCC1.5: C11.1 C112.1 C113.1 C114.1 C115.1 C116.1 U4.A3(VCCO_DDR_502) U4.D2(VCCO_DDR_502) U4.E5(VCCO_DDR_502) U4.G1(VCCO_DDR_502) U4.H4(VCCO_DDR_502) U4.L3(VCCO_DDR_502) U4.P2(VCCO_DDR_502) U4.R5(VCCO_DDR_502) U4.U1(VCCO_DDR_502) U4.V4(VCCO_DDR_502)
VCC1.8: C30.1 C61.1 C74.1 C75.1 C79.1 C87.1 C92.1 C94.1 C96.1 L3.2 L8.2 L9.2 U4.A13(VCCO_MIO1_501) U4.B16(VCCO_MIO1_501) U4.D12(VCCO_MIO1_501) U4.E15(VCCO_MIO1_501) U4.F8(VCCPAUX) U4.G9(VCCPAUX) U4.H8(VCCPAUX) U4.J11(VCCAUX) U4.K8(VCCPAUX) U4.L11(VCCAUX) U4.M8(VCCPAUX) U4.N9(VCCAUX) U4.N11(VCCAUX) U4.P10(VCCAUX) U4.R9(VCCAUX)
VCC3.3: R28.1 R49.1 R53.1
VCC3.3_IO: C14.1 C18.1 C21.1 C22.1 C65.1 C69.1 C70.1 C71.1 C72.1 C73.1 C76.1 C77.1 C78.1 C80.1 C86.1 C89.1 C97.1 C101.1 C102.1 C103.1 C104.1 C105.1 C108.1 R79.2 R80.2 R82.2 U4.B6(VCCO_MIO0_500) U4.C19(VCCO_35) U4.D7(VCCO_MIO0_500) U4.F18(VCCO_35) U4.H14(VCCO_35) U4.J17(VCCO_35) U4.K6(VCCO_0) U4.K20(VCCO_35) U4.M6(CFGBVS_0) U4.M16(VCCO_35) U4.N6(RSVDVCC3) U4.N19(VCCO_34) U4.R6(RSVDVCC2) U4.R15(VCCO_34) U4.T6(RSVDVCC1) U4.T8(VCCO_13) U4.T18(VCCO_34) U4.U11(VCCO_13) U4.V14(VCCO_34) U4.W7(VCCO_13) U4.W17(VCCO_34) U4.Y10(VCCO_13) U4.Y20(VCCO_34)
DONE: R79.1 U4.R11(DONE_0)
INIT_B: R80.1 U4.R10(INIT_B_0)
PROG_B: R82.1 U4.L6(PROGRAM_B_0)
TDO_0: R27.2 U4.F6(TDO_0)
VCCADC: C13.1 C95.1 L8.1 U4.J9(VCCADC_0)
VCCPLL: C100.1 C109.1 L3.1 L9.1 U4.G8(VCCPLL)
ZYNQ_JTAG_TCK: R53.2 U4.F9(TCK_0)
ZYNQ_JTAG_TDI: R49.2 U4.G6(TDI_0)
ZYNQ_JTAG_TDO: R27.1
ZYNQ_JTAG_TMS: R28.2 U4.J6(TMS_0)

Not connected (* = marked no-connect by the designer): U4 M9(DXP_0)* M10(DXN_0)*

### Notes on the sheet
- XADC will use internal VREF
- PS VCCO_MIO1 Caps
- PS VCCO_MIO0 Caps
- PL VCCO_13 Caps
- PL VCCO_34 Caps
- PL VCCAUX Caps
- PL VCCO_35 Caps
- PS VCCAUX Caps
- PS VCCO_DDR Caps
- (near C14) PL VCCO_0 Caps
- PS VCCINT Caps
- PL VCCBRAM Caps
- PL VCCINT Caps
- ZYNQ power wiring and JTAG
- Description
- Title
- Size:
- Date:
- A3
- Number:
- Time:
- Revision:
- Sheet
- of
- File:
- Author:

### Library data of the parts
C11 C16 C18 C20 C30 C61 C64 C65 C67 C68 = Cap: Capacitor; Part: GRM32ER60J107ME20L; Manufacturer: Murata; INVKEY: CP1210-100UF-6.3V-20%; PackageDescription: Chip Capacitor
C13 C21 C22 C69 C72 C73 C76 C78 C79 C81 C83 C85 C86 C88 C89 C92 C93 C96-C100 C102 C103 C106 C108 C112-C114 C116 = Cap: Capacitor; Manufacturer: Murata; Part: GRM155R60J474KE19D; INVKEY: CP0402-0.47UF-6V3-10%; PackageDescription: Chip Capacitor
C14 C74 = Cap: Capacitor; Manufacturer: TDK; Part: C2012X5R0J476M125AC; INVKEY: CP0805-47UF-6.3V; PackageDescription: Chip Capacitor
C70 C71 C75 C77 C80 C82 C84 C87 C90 C94 C101 C104 C105 C107 C115 = Cap: Capacitor; Manufacturer: TDK; Part: C1005X5R0J475M050BC; INVKEY: CP0402-4.7UF-6.3V; PackageDescription: Chip Capacitor
C95 = Cap: as C15 on sheet ZynqMIO; PackageDescription: Chip Capacitor
C109 = Cap: Capacitor; Manufacturer: Murata; Part: GRM155R60J106ME44D; INVKEY: CP0402-10UF-6V3-20%; PackageDescription: Chip Capacitor
L3 L8 L9 = Bead: Bead Inductor; Manufacturer: Taiyo Yuden; Measuring Frequency: 100MHz; INVKEY: FB-BK1005HM241-T; PackageDescription: Chip Inductor; Part: BK1005HM241-T
R27 = Res: as R9 on sheet ZynqMIO; PackageDescription: Chip Resistor
R28 R49 R53 = Res: Resistor; Manufacturer: Panasonic-ECG; Part: ERJ-2GEJ103X; Tolerance: 5%; INVKEY: RS0402-10K-1/10W-5%; PackageDescription: Chip Resistor
R79 R80 R82 = Res: as R62 on sheet ZynqMIO; PackageDescription: Chip Resistor
U4 = XNLX-XC7Z020-CLG400: as U4 on sheet ZynqMIO; INVKEY: ?

## Sheet ZynqDDR.SchDoc: ZYNQ-IPMC
size A3; Author: Marcelo Vicente; CompanyName: Univ. Wisconsin-Madison; Organization: Univ. Wisconsin-Madison; Address1: Madison, WI 53706; DocumentNumber: 8; Revision: revB1; SheetNumber: 8; SheetTotal: 11; ProjectName: ZYNQ-IPMC
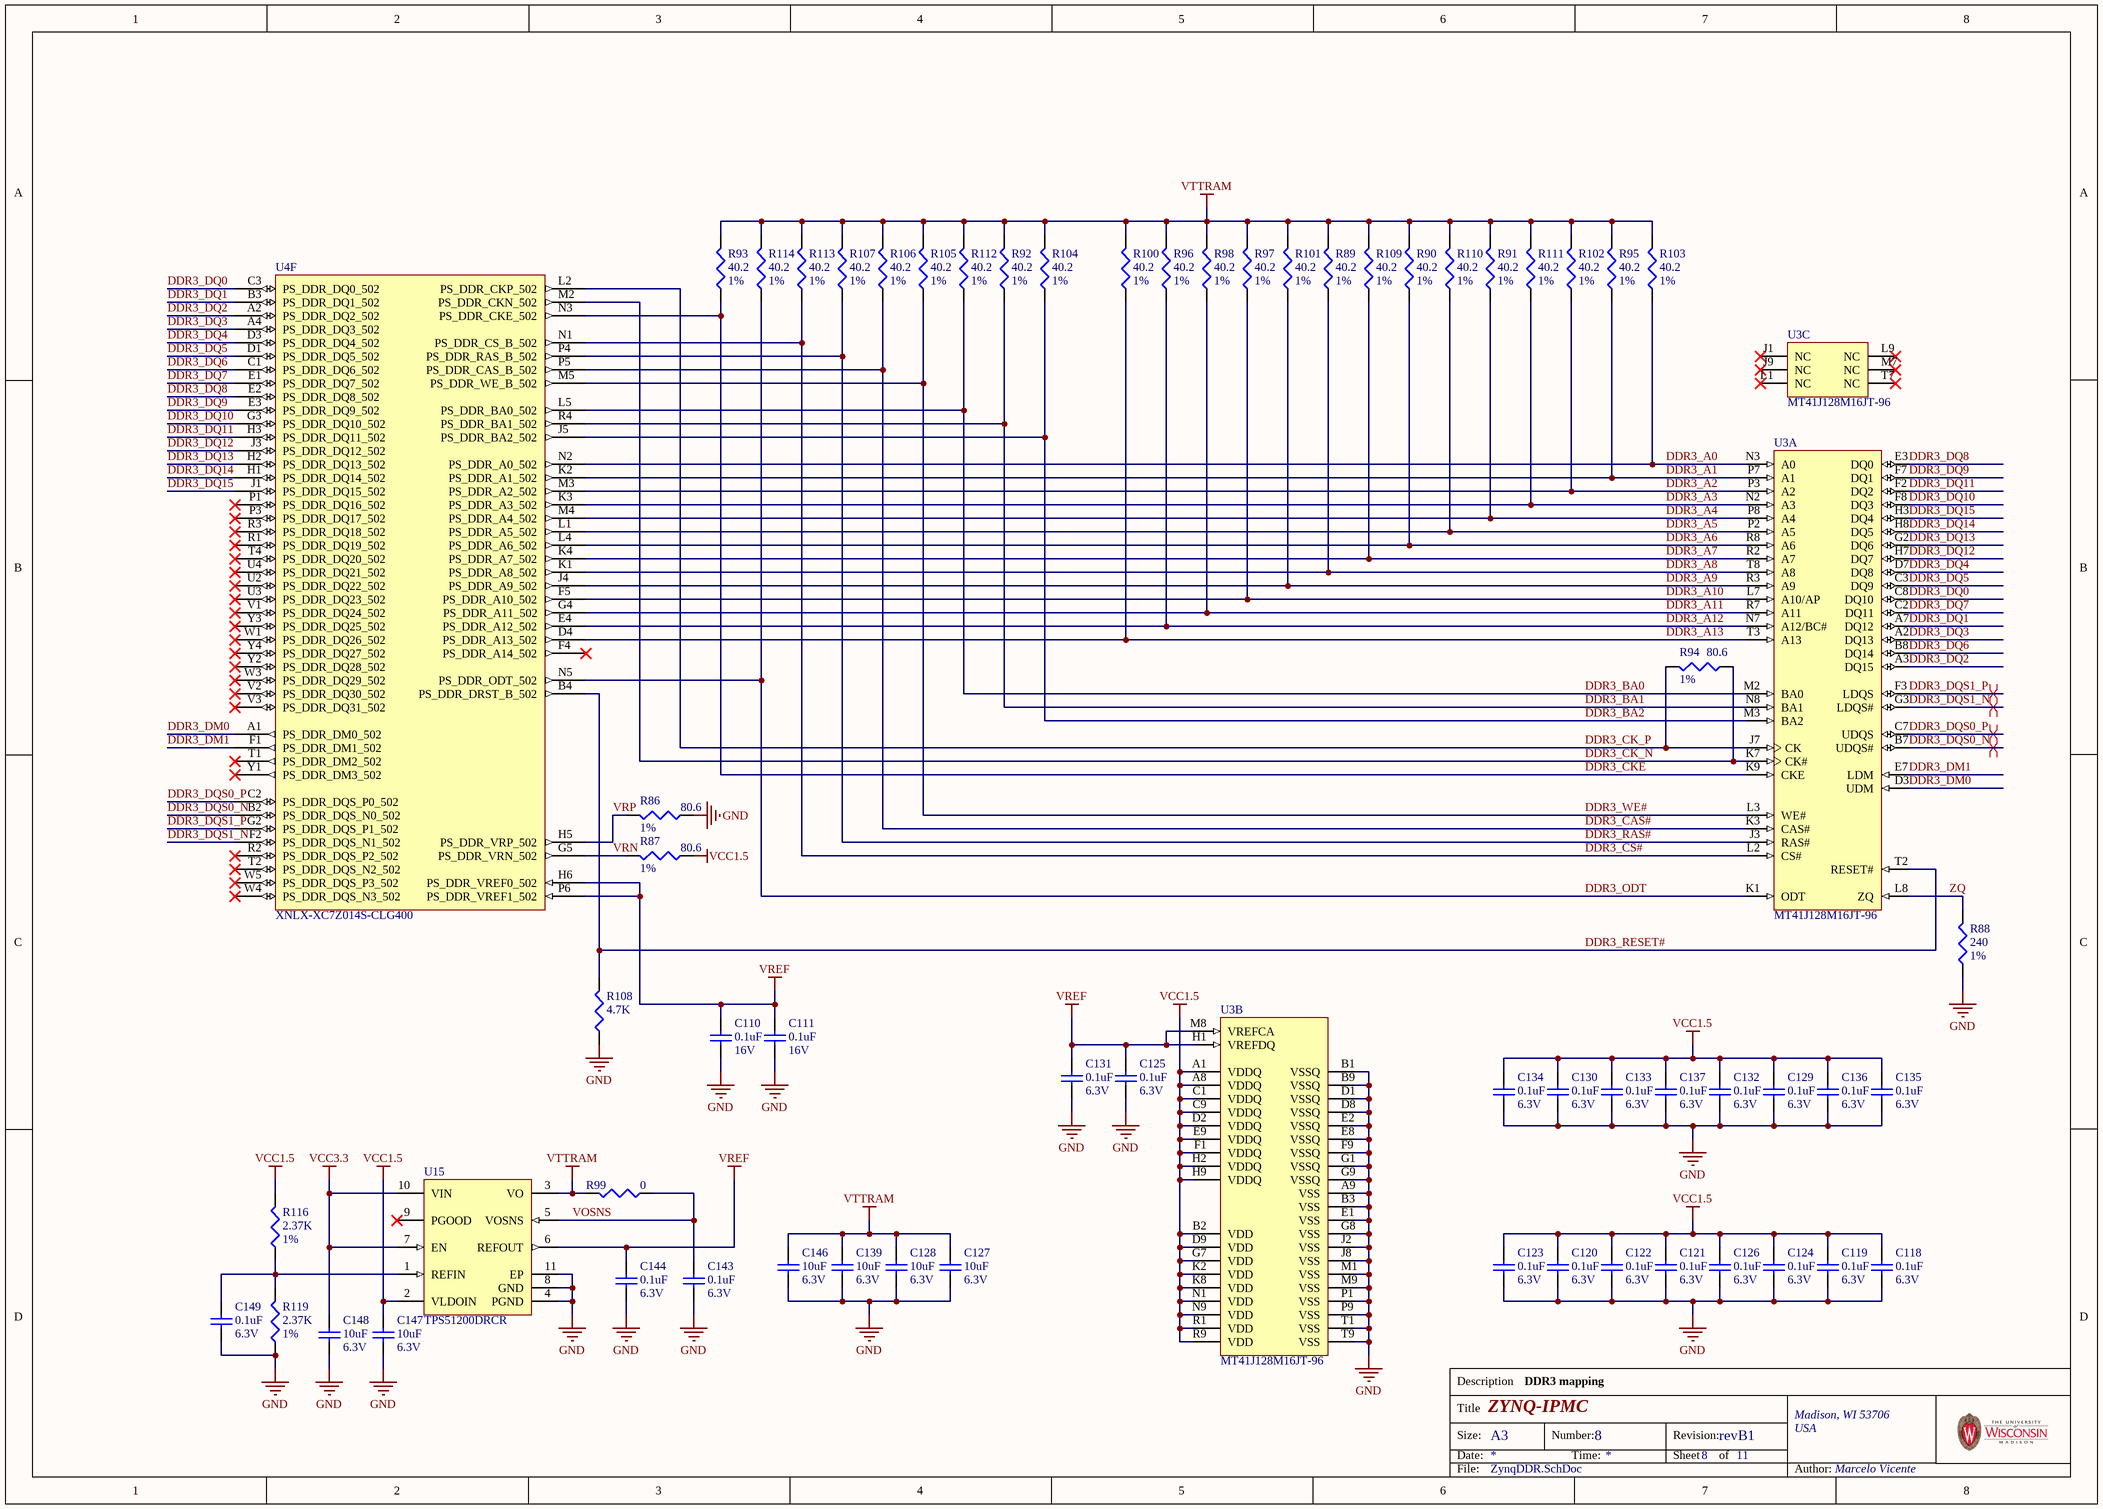
[diagram p5: ZynqDDR.SchDoc]

### Parts
C110  value 0.1uF  Rating: 16V  [C0402_IPC_H]  (hidden comment: ?)
C111  value 0.1uF  Rating: 16V  [C0402_IPC_H]  (hidden comment: ?)
C118  value 0.1uF  Rating: 6.3V  [C0201_IPC_H]  (hidden comment: ?)
C119  value 0.1uF  Rating: 6.3V  [C0201_IPC_H]  (hidden comment: ?)
C120  value 0.1uF  Rating: 6.3V  [C0201_IPC_H]  (hidden comment: ?)
C121  value 0.1uF  Rating: 6.3V  [C0201_IPC_H]  (hidden comment: ?)
C122  value 0.1uF  Rating: 6.3V  [C0201_IPC_H]  (hidden comment: ?)
C123  value 0.1uF  Rating: 6.3V  [C0201_IPC_H]  (hidden comment: ?)
C124  value 0.1uF  Rating: 6.3V  [C0201_IPC_H]  (hidden comment: ?)
C125  value 0.1uF  Rating: 6.3V  [C0201_IPC_H]  (hidden comment: ?)
C126  value 0.1uF  Rating: 6.3V  [C0201_IPC_H]  (hidden comment: ?)
C127  value 10uF  Rating: 6.3V  [C0402_IPC_H]  (hidden comment: ?)
C128  value 10uF  Rating: 6.3V  [C0402_IPC_H]  (hidden comment: ?)
C129  value 0.1uF  Rating: 6.3V  [C0201_IPC_H]  (hidden comment: ?)
C130  value 0.1uF  Rating: 6.3V  [C0201_IPC_H]  (hidden comment: ?)
C131  value 0.1uF  Rating: 6.3V  [C0201_IPC_H]  (hidden comment: ?)
C132  value 0.1uF  Rating: 6.3V  [C0201_IPC_H]  (hidden comment: ?)
C133  value 0.1uF  Rating: 6.3V  [C0201_IPC_H]  (hidden comment: ?)
C134  value 0.1uF  Rating: 6.3V  [C0201_IPC_H]  (hidden comment: ?)
C135  value 0.1uF  Rating: 6.3V  [C0201_IPC_H]  (hidden comment: ?)
C136  value 0.1uF  Rating: 6.3V  [C0201_IPC_H]  (hidden comment: ?)
C137  value 0.1uF  Rating: 6.3V  [C0201_IPC_H]  (hidden comment: ?)
C139  value 10uF  Rating: 6.3V  [C0402_IPC_H]  (hidden comment: ?)
C143  value 0.1uF  Rating: 6.3V  [C0201_IPC_H]  (hidden comment: ?)
C144  value 0.1uF  Rating: 6.3V  [C0201_IPC_H]  (hidden comment: ?)
C146  value 10uF  Rating: 6.3V  [C0402_IPC_H]  (hidden comment: ?)
C147  value 10uF  Rating: 6.3V  [C0402_IPC_H]  (hidden comment: ?)
C148  value 10uF  Rating: 6.3V  [C0402_IPC_H]  (hidden comment: ?)
C149  value 0.1uF  Rating: 6.3V  [C0201_IPC_H]  (hidden comment: ?)
R86  value 80.6  Tolerance: 1%  [R0402_IPC_H]  (hidden comment: ?)
R87  value 80.6  Tolerance: 1%  [R0402_IPC_H]  (hidden comment: ?)
R88  value 240  Tolerance: 1%  [R0402_IPC_H]  (hidden comment: ?)
R89  value 40.2  Tolerance: 1%  [R0201_IPC_H]  (hidden comment: ?)
R90  value 40.2  Tolerance: 1%  [R0201_IPC_H]  (hidden comment: ?)
R91  value 40.2  Tolerance: 1%  [R0201_IPC_H]  (hidden comment: ?)
R92  value 40.2  Tolerance: 1%  [R0201_IPC_H]  (hidden comment: ?)
R93  value 40.2  Tolerance: 1%  [R0201_IPC_H]  (hidden comment: ?)
R94  value 80.6  Tolerance: 1%  [R0402_IPC_H]  (hidden comment: ?)
R95  value 40.2  Tolerance: 1%  [R0201_IPC_H]  (hidden comment: ?)
R96  value 40.2  Tolerance: 1%  [R0201_IPC_H]  (hidden comment: ?)
R97  value 40.2  Tolerance: 1%  [R0201_IPC_H]  (hidden comment: ?)
R98  value 40.2  Tolerance: 1%  [R0201_IPC_H]  (hidden comment: ?)
R99  value 0  [R0402_IPC_H]  (hidden comment: ?)
R100  value 40.2  Tolerance: 1%  [R0201_IPC_H]  (hidden comment: ?)
R101  value 40.2  Tolerance: 1%  [R0201_IPC_H]  (hidden comment: ?)
R102  value 40.2  Tolerance: 1%  [R0201_IPC_H]  (hidden comment: ?)
R103  value 40.2  Tolerance: 1%  [R0201_IPC_H]  (hidden comment: ?)
R104  value 40.2  Tolerance: 1%  [R0201_IPC_H]  (hidden comment: ?)
R105  value 40.2  Tolerance: 1%  [R0201_IPC_H]  (hidden comment: ?)
R106  value 40.2  Tolerance: 1%  [R0201_IPC_H]  (hidden comment: ?)
R107  value 40.2  Tolerance: 1%  [R0201_IPC_H]  (hidden comment: ?)
R108  value 4.7K  [R0402_IPC_H]  (hidden comment: ?)
R109  value 40.2  Tolerance: 1%  [R0201_IPC_H]  (hidden comment: ?)
R110  value 40.2  Tolerance: 1%  [R0201_IPC_H]  (hidden comment: ?)
R111  value 40.2  Tolerance: 1%  [R0201_IPC_H]  (hidden comment: ?)
R112  value 40.2  Tolerance: 1%  [R0201_IPC_H]  (hidden comment: ?)
R113  value 40.2  Tolerance: 1%  [R0201_IPC_H]  (hidden comment: ?)
R114  value 40.2  Tolerance: 1%  [R0201_IPC_H]  (hidden comment: ?)
R116  value 2.37K  Tolerance: 1%  [R0402_IPC_H]  (hidden comment: ?)
R119  value 2.37K  Tolerance: 1%  [R0402_IPC_H]  (hidden comment: ?)
U3  MT41J128M16JT-96  [MICT-JT-96]  (parts A,B,C of 3)
U4  XNLX-XC7Z014S-CLG400  [CLG400]  (part F of 9)
U15  TPS51200DRCR  [DRC0010J_V]

### Nets
GND: C110.1 C111.1 C118.2 C119.2 C120.2 C121.2 C122.2 C123.2 C124.2 C125.1 C126.2 C127.1 C128.1 C129.2 C130.2 C131.1 C132.2 C133.2 C134.2 C135.2 C136.2 C137.2 C139.1 C143.1 C144.1 C146.1 C147.1 C148.1 C149.1 R86.1 R88.1 R108.1 R119.1 U3.A9(VSS) U3.B1(VSSQ) U3.B3(VSS) U3.B9(VSSQ) U3.D1(VSSQ) U3.D8(VSSQ) U3.E1(VSS) U3.E2(VSSQ) U3.E8(VSSQ) U3.F9(VSSQ) U3.G1(VSSQ) U3.G8(VSS) U3.G9(VSSQ) U3.J2(VSS) U3.J8(VSS) U3.M1(VSS) U3.M9(VSS) U3.P1(VSS) U3.P9(VSS) U3.T1(VSS) U3.T9(VSS) U15.4(PGND) U15.8(GND) U15.11(EP)
VCC1.5: C118.1 C119.1 C120.1 C121.1 C122.1 C123.1 C124.1 C126.1 C129.1 C130.1 C132.1 C133.1 C134.1 C135.1 C136.1 C137.1 C147.2 R87.1 R116.2 U3.A1(VDDQ) U3.A8(VDDQ) U3.B2(VDD) U3.C1(VDDQ) U3.C9(VDDQ) U3.D2(VDDQ) U3.D9(VDD) U3.E9(VDDQ) U3.F1(VDDQ) U3.G7(VDD) U3.H2(VDDQ) U3.H9(VDDQ) U3.K2(VDD) U3.K8(VDD) U3.N1(VDD) U3.N9(VDD) U3.R1(VDD) U3.R9(VDD) U15.2(VLDOIN)
VCC3.3: C148.2 U15.7(EN) U15.10(VIN)
VREF: C110.2 C111.2 C125.2 C131.2 C144.2 U3.H1(VREFDQ) U3.M8(VREFCA) U4.H6(PS_DDR_VREF0_502) U4.P6(PS_DDR_VREF1_502) U15.6(REFOUT)
VTTRAM: C127.2 C128.2 C139.2 C146.2 R89.2 R90.2 R91.2 R92.2 R93.2 R95.2 R96.2 R97.2 R98.2 R99.2 R100.2 R101.2 R102.2 R103.2 R104.2 R105.2 R106.2 R107.2 R109.2 R110.2 R111.2 R112.2 R113.2 R114.2 U15.3(VO)
DDR3_A0: R103.1 U3.N3(A0) U4.N2(PS_DDR_A0_502)
DDR3_A1: R95.1 U3.P7(A1) U4.K2(PS_DDR_A1_502)
DDR3_A2: R102.1 U3.P3(A2) U4.M3(PS_DDR_A2_502)
DDR3_A3: R111.1 U3.N2(A3) U4.K3(PS_DDR_A3_502)
DDR3_A4: R91.1 U3.P8(A4) U4.M4(PS_DDR_A4_502)
DDR3_A5: R110.1 U3.P2(A5) U4.L1(PS_DDR_A5_502)
DDR3_A6: R90.1 U3.R8(A6) U4.L4(PS_DDR_A6_502)
DDR3_A7: R109.1 U3.R2(A7) U4.K4(PS_DDR_A7_502)
DDR3_A8: R89.1 U3.T8(A8) U4.K1(PS_DDR_A8_502)
DDR3_A9: R101.1 U3.R3(A9) U4.J4(PS_DDR_A9_502)
DDR3_A10: R97.1 U3.L7(A10/AP) U4.F5(PS_DDR_A10_502)
DDR3_A11: R98.1 U3.R7(A11) U4.G4(PS_DDR_A11_502)
DDR3_A12: R96.1 U3.N7(A12/BC#) U4.E4(PS_DDR_A12_502)
DDR3_A13: R100.1 U3.T3(A13) U4.D4(PS_DDR_A13_502)
DDR3_BA0: R112.1 U3.M2(BA0) U4.L5(PS_DDR_BA0_502)
DDR3_BA1: R92.1 U3.N8(BA1) U4.R4(PS_DDR_BA1_502)
DDR3_BA2: R104.1 U3.M3(BA2) U4.J5(PS_DDR_BA2_502)
DDR3_CAS#: R106.1 U3.K3(CAS#) U4.P5(PS_DDR_CAS_B_502)
DDR3_CK_N: R94.1 U3.K7(CK#) U4.M2(PS_DDR_CKN_502)
DDR3_CK_P: R94.2 U3.J7(CK) U4.L2(PS_DDR_CKP_502)
DDR3_CKE: R93.1 U3.K9(CKE) U4.N3(PS_DDR_CKE_502)
DDR3_CS#: R113.1 U3.L2(CS#) U4.N1(PS_DDR_CS_B_502)
DDR3_DM0: U3.D3(UDM) U4.A1(PS_DDR_DM0_502)
DDR3_DM1: U3.E7(LDM) U4.F1(PS_DDR_DM1_502)
DDR3_DQ0: U3.C8(DQ10) U4.C3(PS_DDR_DQ0_502)
DDR3_DQ1: U3.A7(DQ12) U4.B3(PS_DDR_DQ1_502)
DDR3_DQ2: U3.A3(DQ15) U4.A2(PS_DDR_DQ2_502)
DDR3_DQ3: U3.A2(DQ13) U4.A4(PS_DDR_DQ3_502)
DDR3_DQ4: U3.D7(DQ8) U4.D3(PS_DDR_DQ4_502)
DDR3_DQ5: U3.C3(DQ9) U4.D1(PS_DDR_DQ5_502)
DDR3_DQ6: U3.B8(DQ14) U4.C1(PS_DDR_DQ6_502)
DDR3_DQ7: U3.C2(DQ11) U4.E1(PS_DDR_DQ7_502)
DDR3_DQ8: U3.E3(DQ0) U4.E2(PS_DDR_DQ8_502)
DDR3_DQ9: U3.F7(DQ1) U4.E3(PS_DDR_DQ9_502)
DDR3_DQ10: U3.F8(DQ3) U4.G3(PS_DDR_DQ10_502)
DDR3_DQ11: U3.F2(DQ2) U4.H3(PS_DDR_DQ11_502)
DDR3_DQ12: U3.H7(DQ7) U4.J3(PS_DDR_DQ12_502)
DDR3_DQ13: U3.G2(DQ6) U4.H2(PS_DDR_DQ13_502)
DDR3_DQ14: U3.H8(DQ5) U4.H1(PS_DDR_DQ14_502)
DDR3_DQ15: U3.H3(DQ4) U4.J1(PS_DDR_DQ15_502)
DDR3_DQS0_N: U3.B7(UDQS#) U4.B2(PS_DDR_DQS_N0_502)
DDR3_DQS0_P: U3.C7(UDQS) U4.C2(PS_DDR_DQS_P0_502)
DDR3_DQS1_N: U3.G3(LDQS#) U4.F2(PS_DDR_DQS_N1_502)
DDR3_DQS1_P: U3.F3(LDQS) U4.G2(PS_DDR_DQS_P1_502)
DDR3_ODT: R114.1 U3.K1(ODT) U4.N5(PS_DDR_ODT_502)
DDR3_RAS#: R107.1 U3.J3(RAS#) U4.P4(PS_DDR_RAS_B_502)
DDR3_RESET#: R108.2 U3.T2(RESET#) U4.B4(PS_DDR_DRST_B_502)
DDR3_WE#: R105.1 U3.L3(WE#) U4.M5(PS_DDR_WE_B_502)
VOSNS: C143.2 R99.1 U15.5(VOSNS)
VRN: R87.2 U4.G5(PS_DDR_VRN_502)
VRP: R86.2 U4.H5(PS_DDR_VRP_502)
ZQ: R88.2 U3.L8(ZQ)
NetC149_2: C149.2 R116.1 R119.2 U15.1(REFIN)

Not connected (* = marked no-connect by the designer): U3 J1(NC)* J9(NC)* L1(NC)* L9(NC)* M7(NC)* T7(NC)*; U4 F4(PS_DDR_A14_502)* P1(PS_DDR_DQ16_502)* P3(PS_DDR_DQ17_502)* R1(PS_DDR_DQ19_502)* R2(PS_DDR_DQS_P2_502)* R3(PS_DDR_DQ18_502)* T1(PS_DDR_DM2_502)* T2(PS_DDR_DQS_N2_502)* T4(PS_DDR_DQ20_502)* U2(PS_DDR_DQ22_502)* U3(PS_DDR_DQ23_502)* U4(PS_DDR_DQ21_502)* V1(PS_DDR_DQ24_502)* V2(PS_DDR_DQ30_502)* V3(PS_DDR_DQ31_502)* W1(PS_DDR_DQ26_502)* W3(PS_DDR_DQ29_502)* W4(PS_DDR_DQS_N3_502)* W5(PS_DDR_DQS_P3_502)* Y1(PS_DDR_DM3_502)* Y2(PS_DDR_DQ28_502)* Y3(PS_DDR_DQ25_502)* Y4(PS_DDR_DQ27_502)*; U15 9(PGOOD)*

### Layout directives
differential pair: DDR3_DQS0_N, DDR3_DQS0_P, DDR3_DQS1_N, DDR3_DQS1_P

### Notes on the sheet
- DDR3 mapping
- Description
- Title
- Size:
- Date:
- A3
- Number:
- Time:
- Revision:
- Sheet
- of
- File:
- Author:

### Library data of the parts
C110 C111 = Cap: as C15 on sheet ZynqMIO; PackageDescription: Chip Capacitor
C118-C126 C129-C137 C143 C144 C149 = Cap: Capacitor; Manufacturer: Murata; Part: GRM033R60J104KE19D; INVKEY: CP0201-0.1UF-6.3V-10%; PackageDescription: Chip Capacitor
C127 C128 C139 C146-C148 = Cap: as C109 on sheet ZynqPower; PackageDescription: Chip Capacitor
R86 R87 R94 = Res: Resistor; Manufacturer: Panasonic-ECG; Part: ERJ-2RKF80R6X; INVKEY: RS0402-80R6-1/10W-1%; PackageDescription: Chip Resistor
R88 = Res: Resistor; Manufacturer: Panasonic-ECG; Part: ERJ-2RKF2400X; INVKEY: RS0402-240R-1/10W-1%; PackageDescription: Chip Resistor
R89-R93 R95-R98 R100-R107 R109-R114 = Res: Resistor; Manufacturer: Panasonic-ECG; Part: ERJ-1GEF40R2C; INVKEY: RS0201-40R2-1/20W-1%; PackageDescription: Chip Resistor
R99 = Res: Resistor; Manufacturer: Panasonic-ECG; Part: ERJ-2GE0R00X; Tolerance: 5%; INVKEY: RS0402-0R-1/10W-5%; PackageDescription: Chip Resistor
R108 = Res: as R62 on sheet ZynqMIO; PackageDescription: Chip Resistor
R116 R119 = Res: Resistor; Manufacturer: Panasonic; Part: ERJ-2RKF2371X; INVKEY: RS0402-2K37-1/10W-1%; PackageDescription: Chip Resistor
U3 = MT41J128M16JT-96: Manufacturer: Micron; Part: MT41J128M16JT-125; Note: Any speed grade will work; INVKEY: IC-DRAM-MT41J-2GB-JT
U4 = XNLX-XC7Z020-CLG400: as U4 on sheet ZynqMIO; INVKEY: ?
U15 = CMP-0395-00664-2: Single Output LDO, 3 A, 2.375 to 3.5 V Input, with DDR Termination, 10-pin SON (DRC), -40 to 85 degC, Green (RoHS & no Sb/Br); Manufacturer: Texas Instruments; Vin(Min)(V): 2.3; Vin(Max)(V): 3.5; SubFamily: Single Channel LDO; Iout(Max)(A): 3; Power Good: TRUE; Iq(Typ)(mA): 0.5; Rating: Catalog; INVKEY: IC-DDRTERM-REG-PPSON10; ComponentLink1URL: http://www.ti.com/; ComponentLink3URL: http://www.ti.com/litv/pdf/mpds117k; PackageVersion: 4204102-3/L; Mounting Technology: Surface Mount; DatasheetVersion: SLUS812; Eco-Plan: Green (RoHS & no Sb/Br); ComponentLink4URL: Samples URL:http://www.ti.com/product/tps51200#samples; ComponentLink3Description: Package Specification; PackageReference: DRC0010J; ComponentLink2URL: http://www.ti.com/general/docs/lit/getliterature.tsp?genericPartNumber=TPS51200&fileType=pdf; ComponentLink2Description: Datasheet; PartNumber: TPS51200DRCR; PackageDescription: 10-Pin Plastic Small Outline, Body 3 x 3 mm, Pitch 0.5 mm; ComponentLink4Description: URL Link1; ComponentLink1Description: Manufacturer URL; Part: TPS51200DRCR

## Sheet Ethernet.SchDoc: ZYNQ-IPMC
size A3; Author: Marcelo Vicente; CompanyName: Univ. Wisconsin-Madison; Organization: Univ. Wisconsin-Madison; Address1: Madison, WI 53706; DocumentNumber: 10; Revision: revB1; SheetNumber: 10; SheetTotal: 11; ProjectName: ZYNQ-IPMC
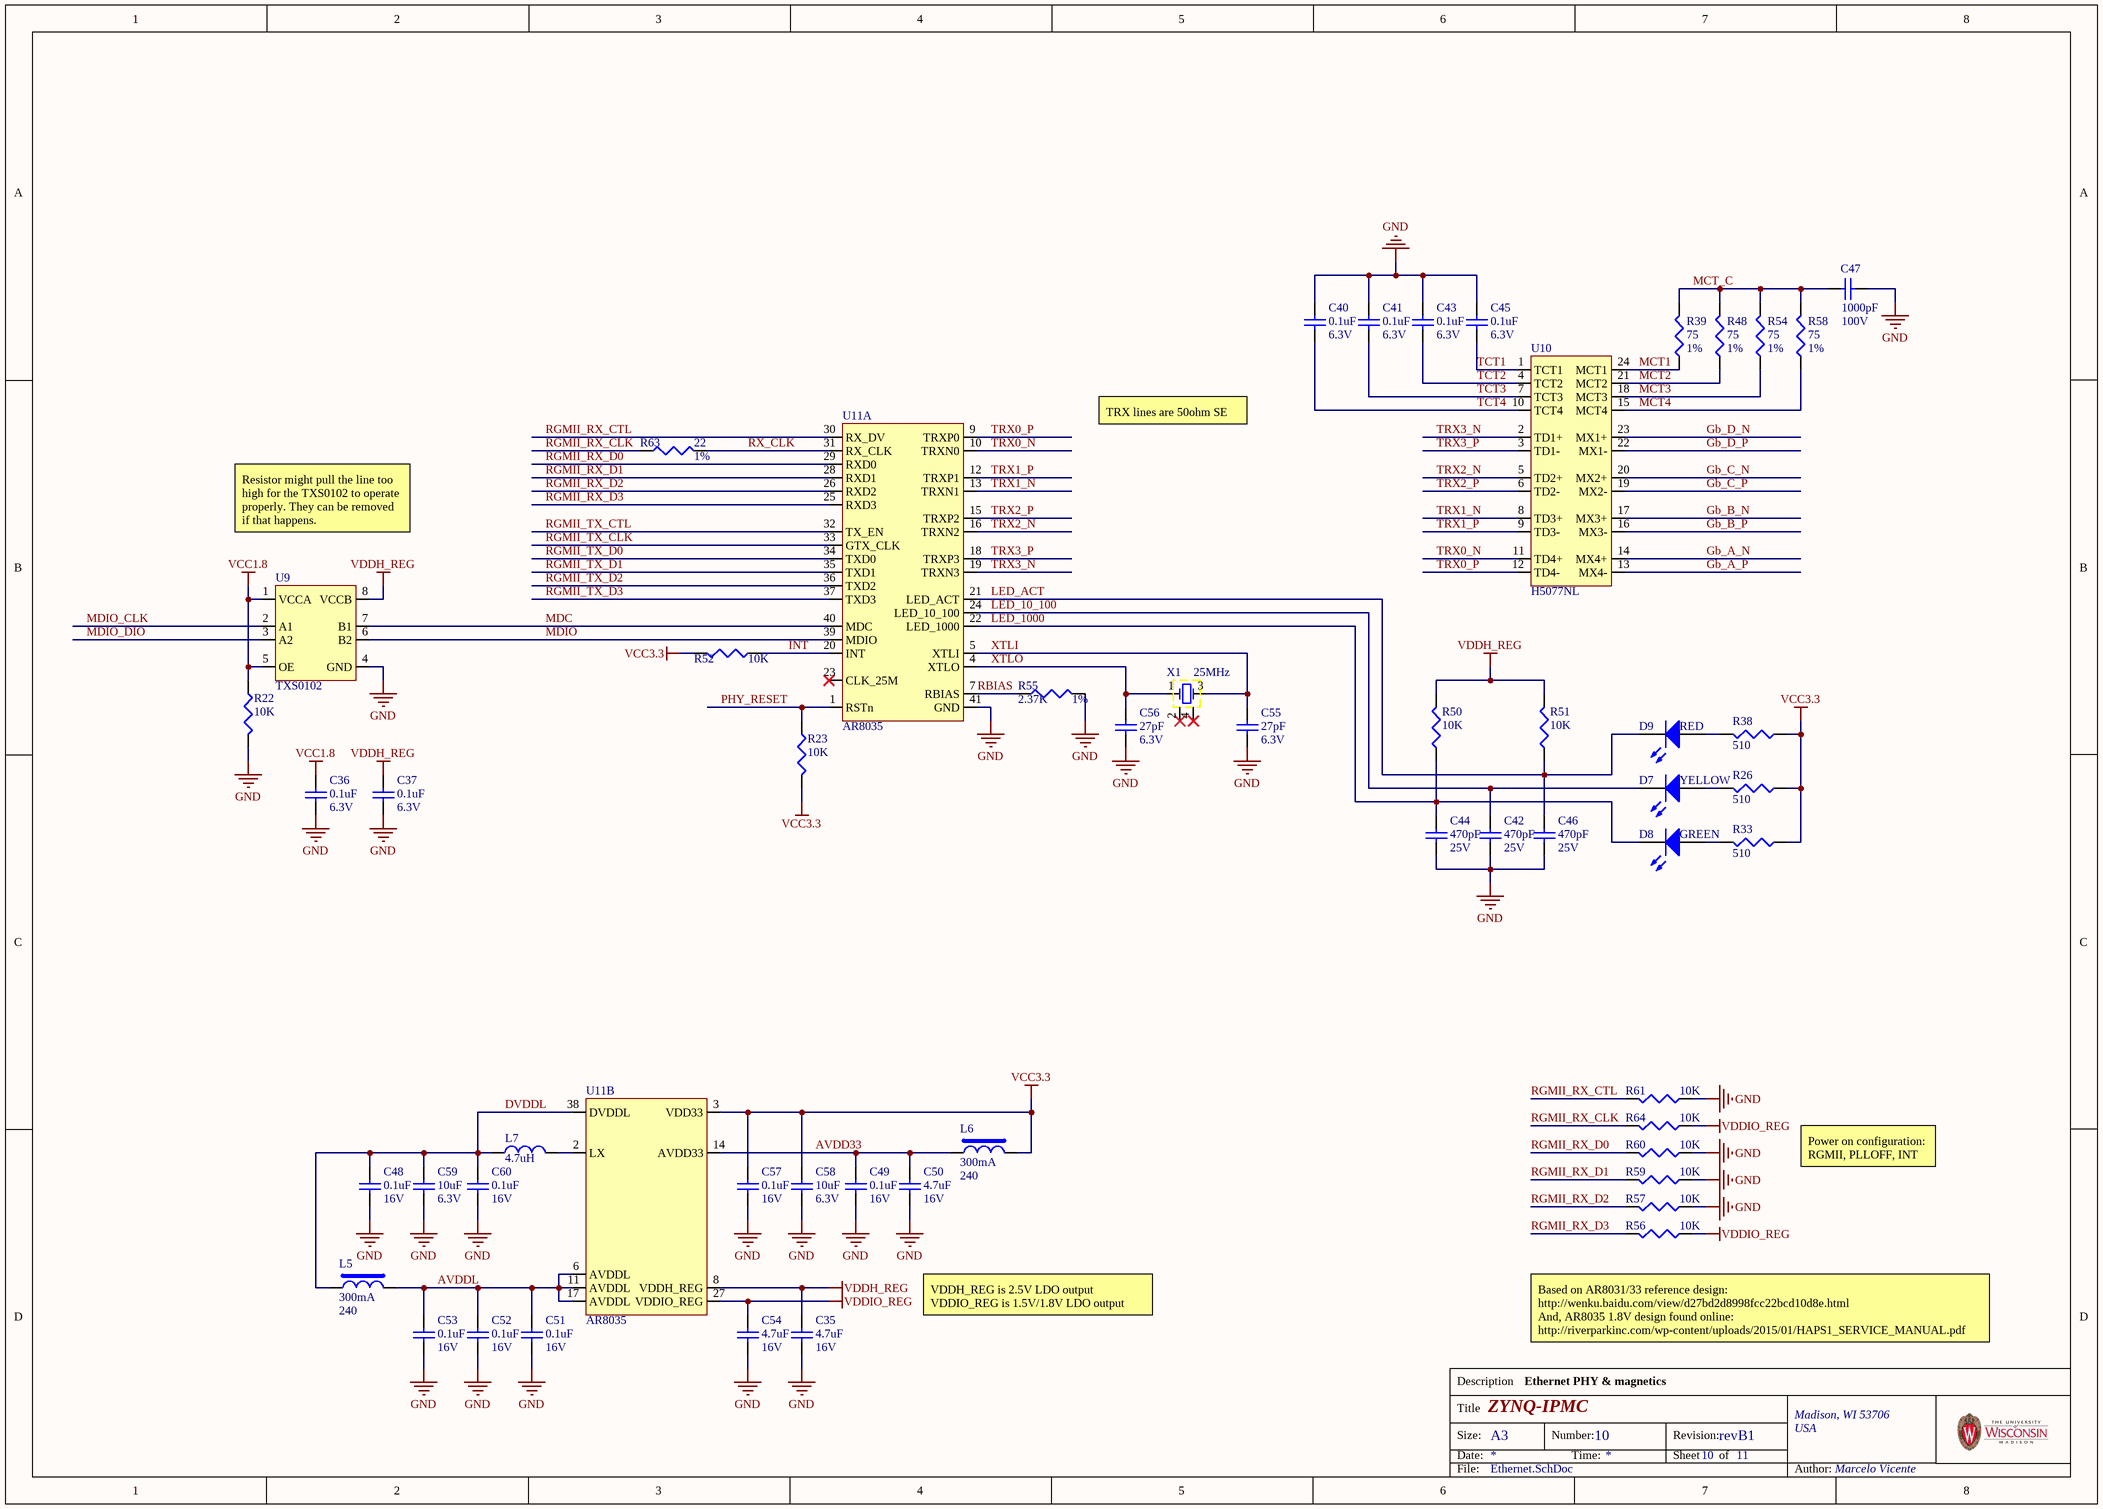
[diagram p6: Ethernet.SchDoc]

### Parts
C35  value 4.7uF  Rating: 16V  [C0402_IPC_H]  (hidden comment: ?)
C36  value 0.1uF  Rating: 6.3V  [C0201_IPC_H]  (hidden comment: ?)
C37  value 0.1uF  Rating: 6.3V  [C0201_IPC_H]  (hidden comment: ?)
C40  value 0.1uF  Rating: 6.3V  [C0201_IPC_H]  (hidden comment: ?)
C41  value 0.1uF  Rating: 6.3V  [C0201_IPC_H]  (hidden comment: ?)
C42  value 470pF  Rating: 25V  [C0201_IPC_H]  (hidden comment: ?)
C43  value 0.1uF  Rating: 6.3V  [C0201_IPC_H]  (hidden comment: ?)
C44  value 470pF  Rating: 25V  [C0201_IPC_H]  (hidden comment: ?)
C45  value 0.1uF  Rating: 6.3V  [C0201_IPC_H]  (hidden comment: ?)
C46  value 470pF  Rating: 25V  [C0201_IPC_H]  (hidden comment: ?)
C47  value 1000pF  Rating: 100V  [C0402_IPC_H]  (hidden comment: ?)
C48  value 0.1uF  Rating: 16V  [C0402_IPC_H]  (hidden comment: ?)
C49  value 0.1uF  Rating: 16V  [C0402_IPC_H]  (hidden comment: ?)
C50  value 4.7uF  Rating: 16V  [C0402_IPC_H]  (hidden comment: ?)
C51  value 0.1uF  Rating: 16V  [C0402_IPC_H]  (hidden comment: ?)
C52  value 0.1uF  Rating: 16V  [C0402_IPC_H]  (hidden comment: ?)
C53  value 0.1uF  Rating: 16V  [C0402_IPC_H]  (hidden comment: ?)
C54  value 4.7uF  Rating: 16V  [C0402_IPC_H]  (hidden comment: ?)
C55  value 27pF  Rating: 6.3V  [C0201_IPC_H]  (hidden comment: ?)
C56  value 27pF  Rating: 6.3V  [C0201_IPC_H]  (hidden comment: ?)
C57  value 0.1uF  Rating: 16V  [C0402_IPC_H]  (hidden comment: ?)
C58  value 10uF  Rating: 6.3V  [C0402_IPC_H]  (hidden comment: ?)
C59  value 10uF  Rating: 6.3V  [C0402_IPC_H]  (hidden comment: ?)
C60  value 0.1uF  Rating: 16V  [C0402_IPC_H]  (hidden comment: ?)
D7  value YELLOW  [LED0603_M]  (hidden comment: ?)
D8  value GREEN  [LED0603_M]  (hidden comment: ?)
D9  value RED  [LED0603_M]  (hidden comment: ?)
L5  value 240  Rated Current: 300mA  [L0402_H]  (hidden comment: BK1005HM241-T)
L6  value 240  Rated Current: 300mA  [L0402_H]  (hidden comment: BK1005HM241-T)
L7  value 4.7uH  [L2520_H]  (hidden comment: Wurth 74438323047)
R22  value 10K  [R0402_IPC_H]  (hidden comment: ?)
R23  value 10K  [R0201_IPC_H]  (hidden comment: ?)
R26  value 510  [R0402_IPC_H]  (hidden comment: ?)
R33  value 510  [R0402_IPC_H]  (hidden comment: ?)
R38  value 510  [R0402_IPC_H]  (hidden comment: ?)
R39  value 75  Tolerance: 1%  [R0402_IPC_H]  (hidden comment: ?)
R48  value 75  Tolerance: 1%  [R0402_IPC_H]  (hidden comment: ?)
R50  value 10K  [R0201_IPC_H]  (hidden comment: ?)
R51  value 10K  [R0201_IPC_H]  (hidden comment: ?)
R52  value 10K  [R0402_IPC_H]  (hidden comment: ?)
R54  value 75  Tolerance: 1%  [R0402_IPC_H]  (hidden comment: ?)
R55  value 2.37K  Tolerance: 1%  [R0402_IPC_H]  (hidden comment: ?)
R56  value 10K  [R0402_IPC_H]  (hidden comment: ?)
R57  value 10K  [R0402_IPC_H]  (hidden comment: ?)
R58  value 75  Tolerance: 1%  [R0402_IPC_H]  (hidden comment: ?)
R59  value 10K  [R0402_IPC_H]  (hidden comment: ?)
R60  value 10K  [R0402_IPC_H]  (hidden comment: ?)
R61  value 10K  [R0402_IPC_H]  (hidden comment: ?)
R63  value 22  Tolerance: 1%  [R0201_IPC_H]  (hidden comment: ?)
R64  value 10K  [R0402_IPC_H]  (hidden comment: ?)
U9  TXS0102  [X2SON-8_H]
U10  H5077NL  [H5077NL]
U11  AR8035  [QFN40_H]  (parts A,B of 2)
X1  value 25MHz  [XRCGB_F]  (hidden comment: XRCGB25M000F3M00R0)

### Nets
GND: C35.1 C36.1 C37.1 C40.2 C41.2 C42.1 C43.2 C44.1 C45.2 C46.1 C47.1 C48.1 C49.1 C50.1 C51.1 C52.1 C53.1 C54.1 C55.1 C56.1 C57.1 C58.1 C59.1 C60.1 R22.2 R55.2 R57.1 R59.1 R60.1 R61.1 U9.4(GND) U11.41(GND)
VCC1.8: C36.2 R22.1 U9.1(VCCA) U9.5(OE)
VCC3.3: C57.2 C58.2 L6.2 R23.2 R26.1 R33.1 R38.1 R52.2 U11.3(VDD33)
VDDH_REG: C35.2 C37.2 R50.2 R51.2 U9.8(VCCB) U11.8(VDDH_REG)
VDDIO_REG: C54.2 R56.1 R64.1 U11.27(VDDIO_REG)
AVDD33: C49.2 C50.2 L6.1 U11.14(AVDD33)
AVDDL: C51.2 C52.2 C53.2 L5.2 U11.6(AVDDL) U11.11(AVDDL) U11.17(AVDDL)
DVDDL: C48.2 C59.2 C60.2 L5.1 L7.1 U11.38(DVDDL)
Gb_A_N: U10.14(MX4+)
Gb_A_P: U10.13(MX4-)
Gb_B_N: U10.17(MX3+)
Gb_B_P: U10.16(MX3-)
Gb_C_N: U10.20(MX2+)
Gb_C_P: U10.19(MX2-)
Gb_D_N: U10.23(MX1+)
Gb_D_P: U10.22(MX1-)
INT: R52.1 U11.20(INT)
LED_10_100: C42.2 D7.2(K) U11.24(LED_10_100)
LED_1000: C44.2 D8.2(K) R50.1 U11.22(LED_1000)
LED_ACT: C46.2 D9.2(K) R51.1 U11.21(LED_ACT)
MCT1: R39.1 U10.24(MCT1)
MCT2: R48.1 U10.21(MCT2)
MCT3: R54.1 U10.18(MCT3)
MCT4: R58.1 U10.15(MCT4)
MCT_C: C47.2 R39.2 R48.2 R54.2 R58.2
MDC: U9.7(B1) U11.40(MDC)
MDIO: U9.6(B2) U11.39(MDIO)
MDIO_CLK: U9.2(A1)
MDIO_DIO: U9.3(A2)
PHY_RESET: R23.1 U11.1(RSTn)
RBIAS: R55.1 U11.7(RBIAS)
RGMII_RX_CLK: R63.1 R64.2
RGMII_RX_CTL: R61.2 U11.30(RX_DV)
RGMII_RX_D0: R60.2 U11.29(RXD0)
RGMII_RX_D1: R59.2 U11.28(RXD1)
RGMII_RX_D2: R57.2 U11.26(RXD2)
RGMII_RX_D3: R56.2 U11.25(RXD3)
RGMII_TX_CLK: U11.33(GTX_CLK)
RGMII_TX_CTL: U11.32(TX_EN)
RGMII_TX_D0: U11.34(TXD0)
RGMII_TX_D1: U11.35(TXD1)
RGMII_TX_D2: U11.36(TXD2)
RGMII_TX_D3: U11.37(TXD3)
RX_CLK: R63.2 U11.31(RX_CLK)
TCT1: C45.1 U10.1(TCT1)
TCT2: C43.1 U10.4(TCT2)
TCT3: C41.1 U10.7(TCT3)
TCT4: C40.1 U10.10(TCT4)
TRX0_N: U10.11(TD4+) U11.10(TRXN0)
TRX0_P: U10.12(TD4-) U11.9(TRXP0)
TRX1_N: U10.8(TD3+) U11.13(TRXN1)
TRX1_P: U10.9(TD3-) U11.12(TRXP1)
TRX2_N: U10.5(TD2+) U11.16(TRXN2)
TRX2_P: U10.6(TD2-) U11.15(TRXP2)
TRX3_N: U10.2(TD1+) U11.19(TRXN3)
TRX3_P: U10.3(TD1-) U11.18(TRXP3)
XTLI: C55.2 U11.5(XTLI) X1.3
XTLO: C56.2 U11.4(XTLO) X1.1
NetD7_1: D7.1(A) R26.2
NetD8_1: D8.1(A) R33.2
NetD9_1: D9.1(A) R38.2
NetL7_2: L7.2 U11.2(LX)

Not connected (* = marked no-connect by the designer): U11 23(CLK_25M)*; X1 2* 4*

### Notes on the sheet
- TRX lines are 50ohm SE
- Resistor might pull the line too high for the TXS0102 to operate properly. They can be removed if that happens.
- Power on configuration:
  RGMII, PLLOFF, INT
- VDDH_REG is 2.5V LDO output
  VDDIO_REG is 1.5V/1.8V LDO output
- Ethernet PHY & magnetics
- (near R56) Based on AR8031/33 reference design:
  http://wenku.baidu.com/view/d27bd2d8998fcc22bcd10d8e.html
  And, AR8035 1.8V design found online:
  http://riverparkinc.com/wp-content/uploads/2015/01/HAPS1_SERVICE_MANUAL.pdf
- Description
- Title
- Size:
- Date:
- A3
- Number:
- Time:
- Revision:
- Sheet
- of
- File:
- Author:

### Library data of the parts
C35 C50 C54 = Cap: Capacitor; Manufacturer: AVX; Part: 0402YD475MAT2A; INVKEY: CP0402-4.7uf-16V-20%; PackageDescription: Chip Capacitor
C36 C37 C40 C41 C43 C45 = Cap: as C118 on sheet ZynqDDR; PackageDescription: Chip Capacitor
C42 C44 C46 = Cap: Capacitor; Manufacturer: TDK; Part: C0603X7R1E471K030BA; INVKEY: CP0201-470PF-25V-10%; PackageDescription: Chip Capacitor
C47 = Cap: Capacitor; Manufacturer: Murata; Part: GRM155R72A102KA01D; INVKEY: CP0402-1000PF-100V-10%; PackageDescription: Chip Capacitor
C48 C49 C51-C53 C57 C60 = Cap: as C15 on sheet ZynqMIO; PackageDescription: Chip Capacitor
C55 C56 = Cap: Capacitor; Manufacturer: Murata; Part: GJM0335C0J270JB01D; INVKEY: CP0201-27PF-6V3-5%; PackageDescription: Chip Capacitor
C58 C59 = Cap: as C109 on sheet ZynqPower; PackageDescription: Chip Capacitor
D7 = LED: as D4 on sheet ZynqMIO
D8 = LED: Light Emitting Diode; Manufacturer: Lite-On; Part: LTST-C190KGKT; INVKEY: LED-GN-TOP-0603
D9 = LED: as D3 on sheet ZynqMIO
L5 L6 = Bead: as L3 on sheet ZynqPower; PackageDescription: Chip Inductor; Part: BK1005HM241-T
L7 = Ind: Inductor; Tolerance: 20%; DC Resistance: 338mOhm; DC Current: 0.94A; INVKEY: IND-74438323047; PackageDescription: Chip Inductor; Manufacturer: Wurth; Part: 74438323047
R22 R52 R56 R57 R59-R61 R64 = Res: as R28 on sheet ZynqPower; PackageDescription: Chip Resistor
R23 R50 R51 = Res: as R29 on sheet ZynqMIO; PackageDescription: Chip Resistor
R26 R33 R38 = Res: as R6 on sheet ZynqEMIO; PackageDescription: Chip Resistor
R39 R48 R54 R58 = Res: Resistor; Manufacturer: Panasonic; Part: ERJ-2RKF75R0X; INVKEY: RS0402-75R-1/10W-1%; PackageDescription: Chip Resistor
R55 = Res: as R116 on sheet ZynqDDR; PackageDescription: Chip Resistor
R63 = Res: as R77 on sheet ZynqMIO; PackageDescription: Chip Resistor
U9 = TXS0102: 2-Bit Bidirectional Voltage-Level Translator for Open-Drain and Push-Pull Applications; Manufacturer: Texas Instruments; Part: TXS0102DQER; INVKEY: IC-TXS0102DQER
U10 = H5077NL: 1000Base-T, Single Port Mini-Magnetics Modules; Manufacturer: Pulse Electronics; INVKEY: IC-XFRM-MINIMAG-1000BASE-T; Part: H5077NL
U11 = AR8035: Integrated 10/100/1000 Gigabit Ethernet Transceiver; Manufacturer: Atheros; INVKEY: IC-TXRX-AR8035; Part: AR8035
X1 = Crystal Osc: Standard Crystal Oscillator; Manufacturer: Murata; INVKEY: CRY-XRCGB-25.0000MHZ; Part: XRCGB25M000F3M00R0